# EAGLE design Drive Board 2018-19 (EAGLE 7.6.0)
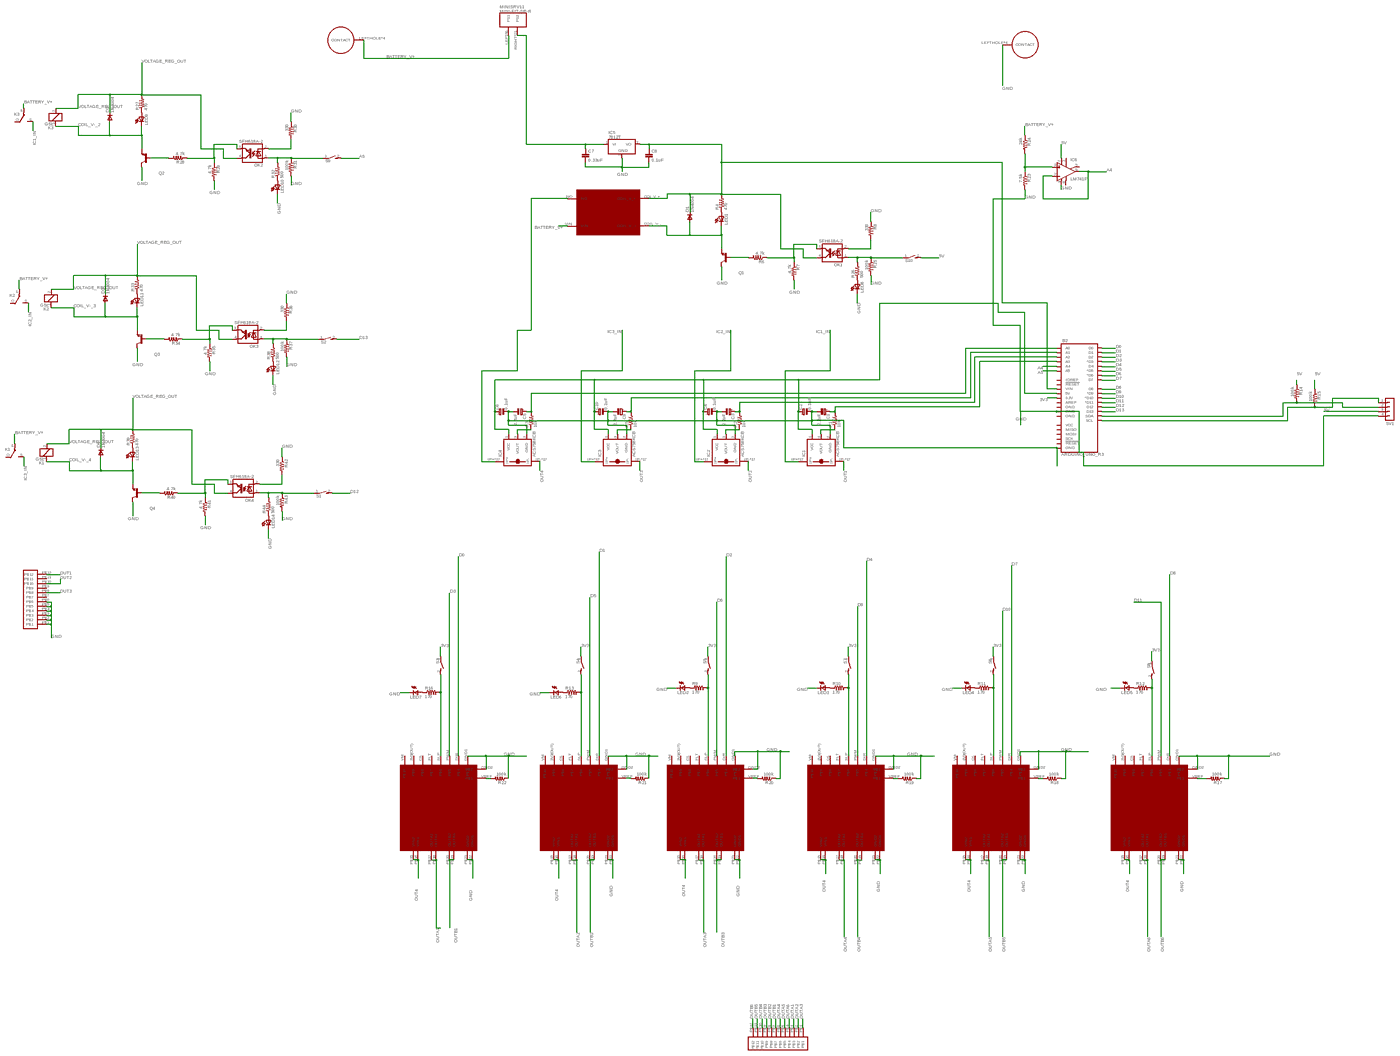
[diagram p0: schematic, sheet 1, overview]
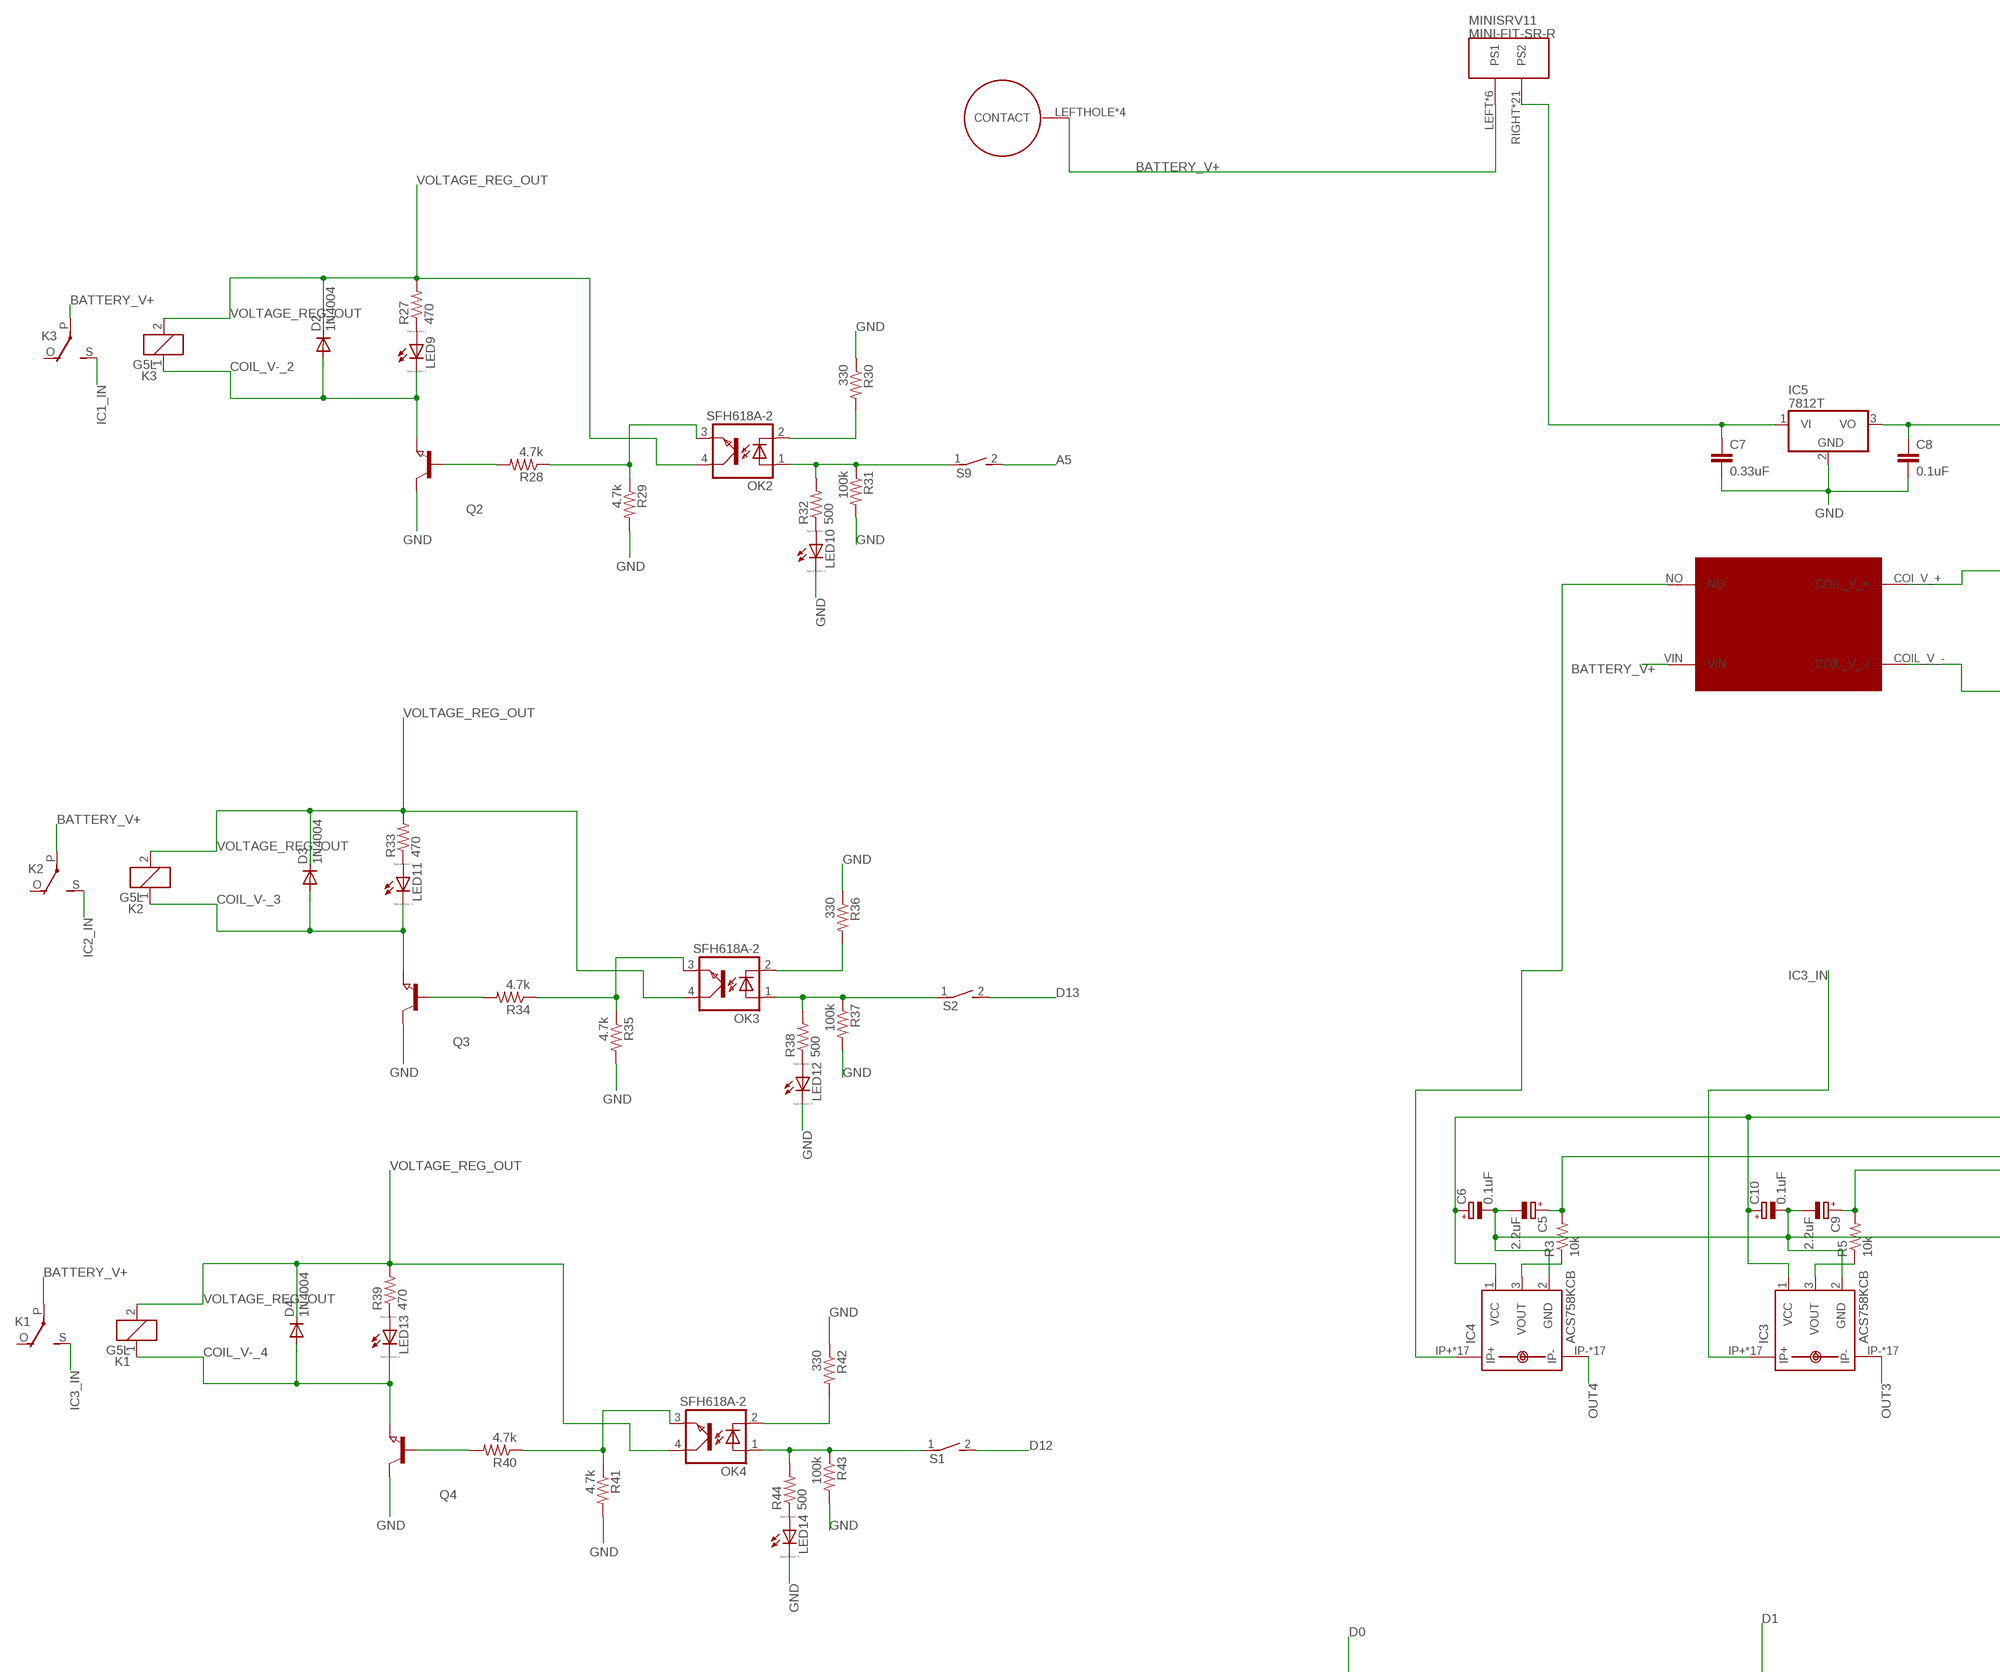
[diagram p1: schematic, sheet 1, part 1 of 4]
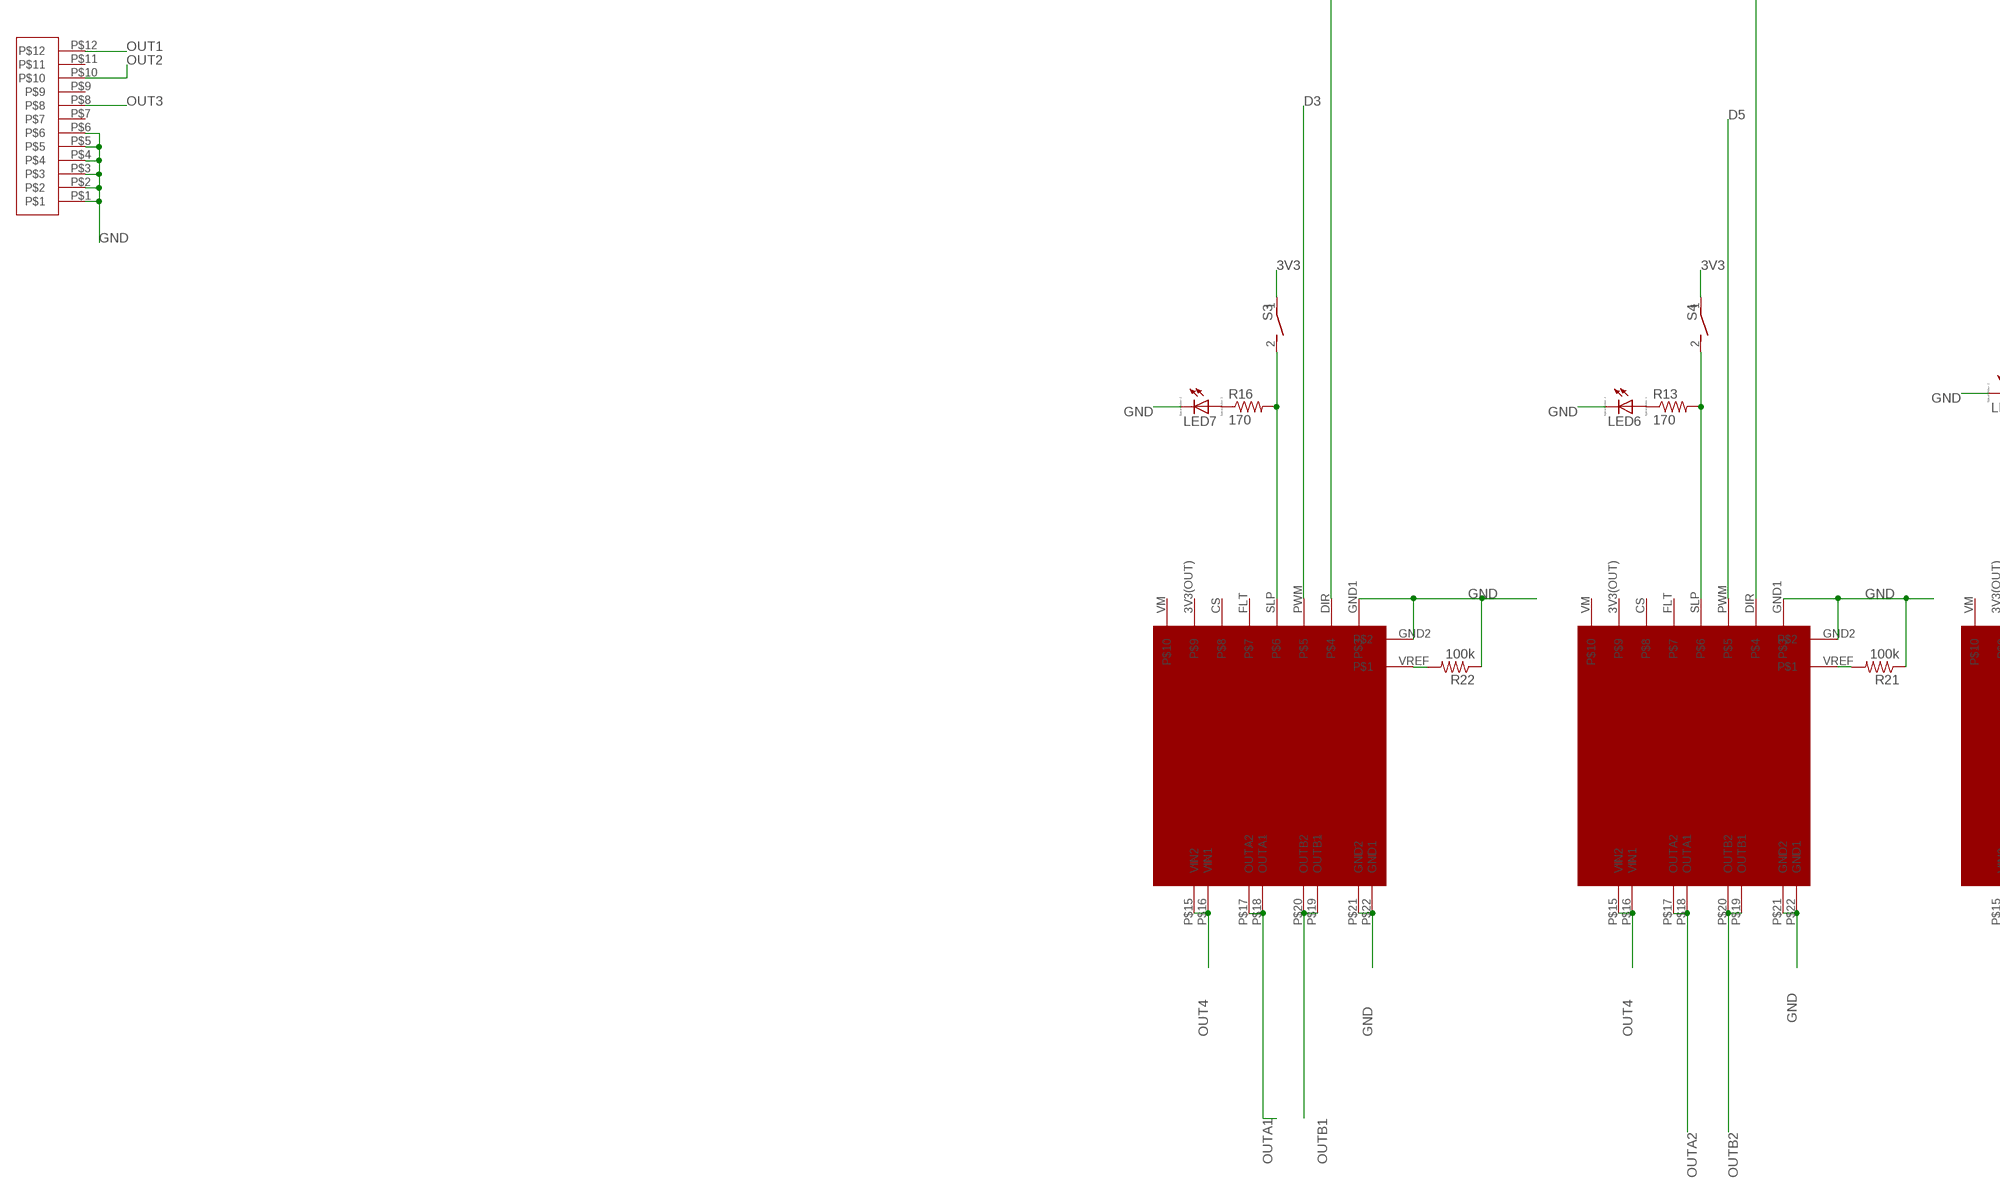
[diagram p2: schematic, sheet 1, part 2 of 4]
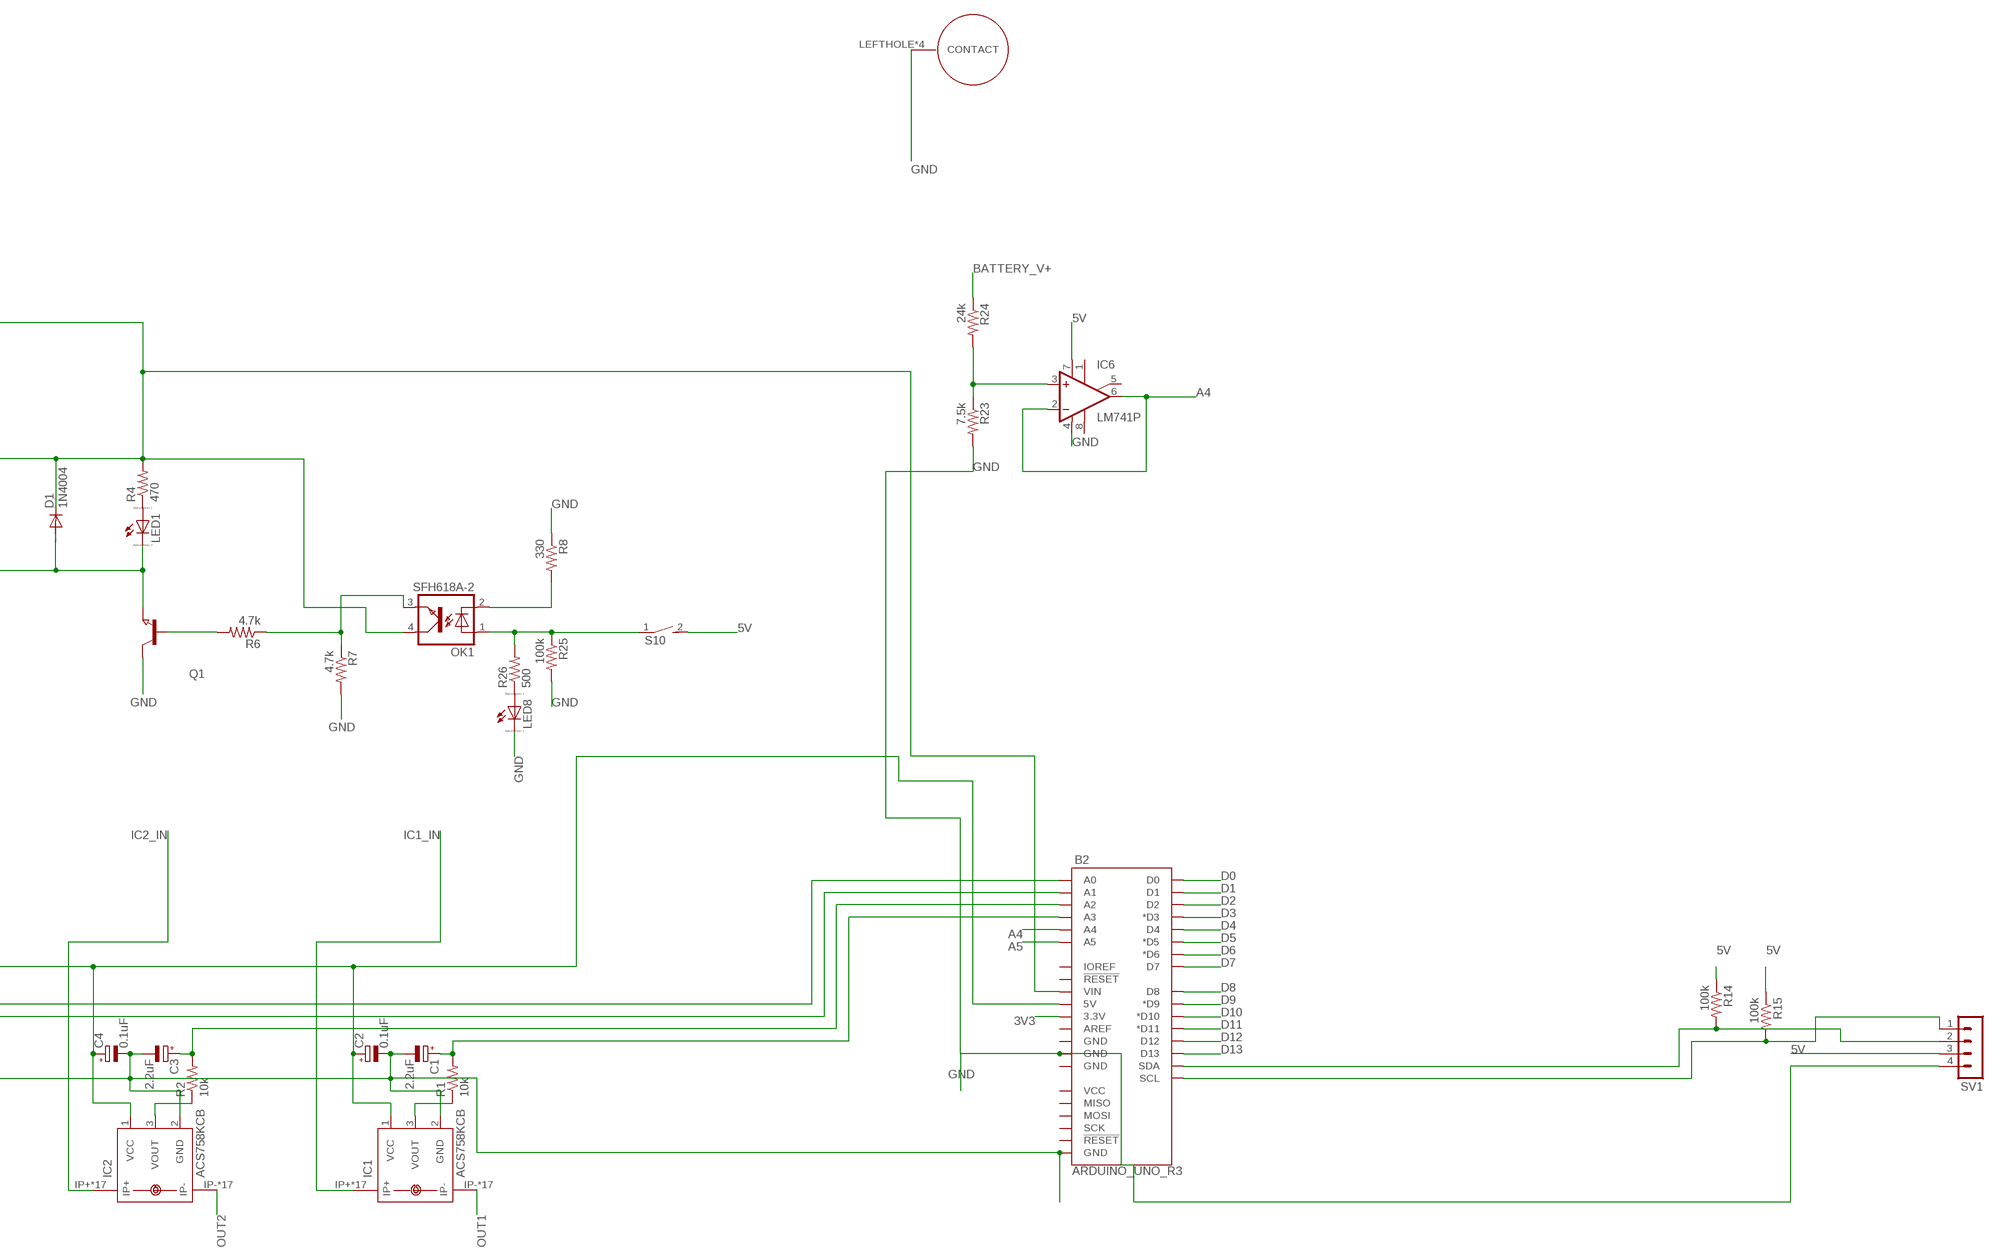
[diagram p3: schematic, sheet 1, part 3 of 4]
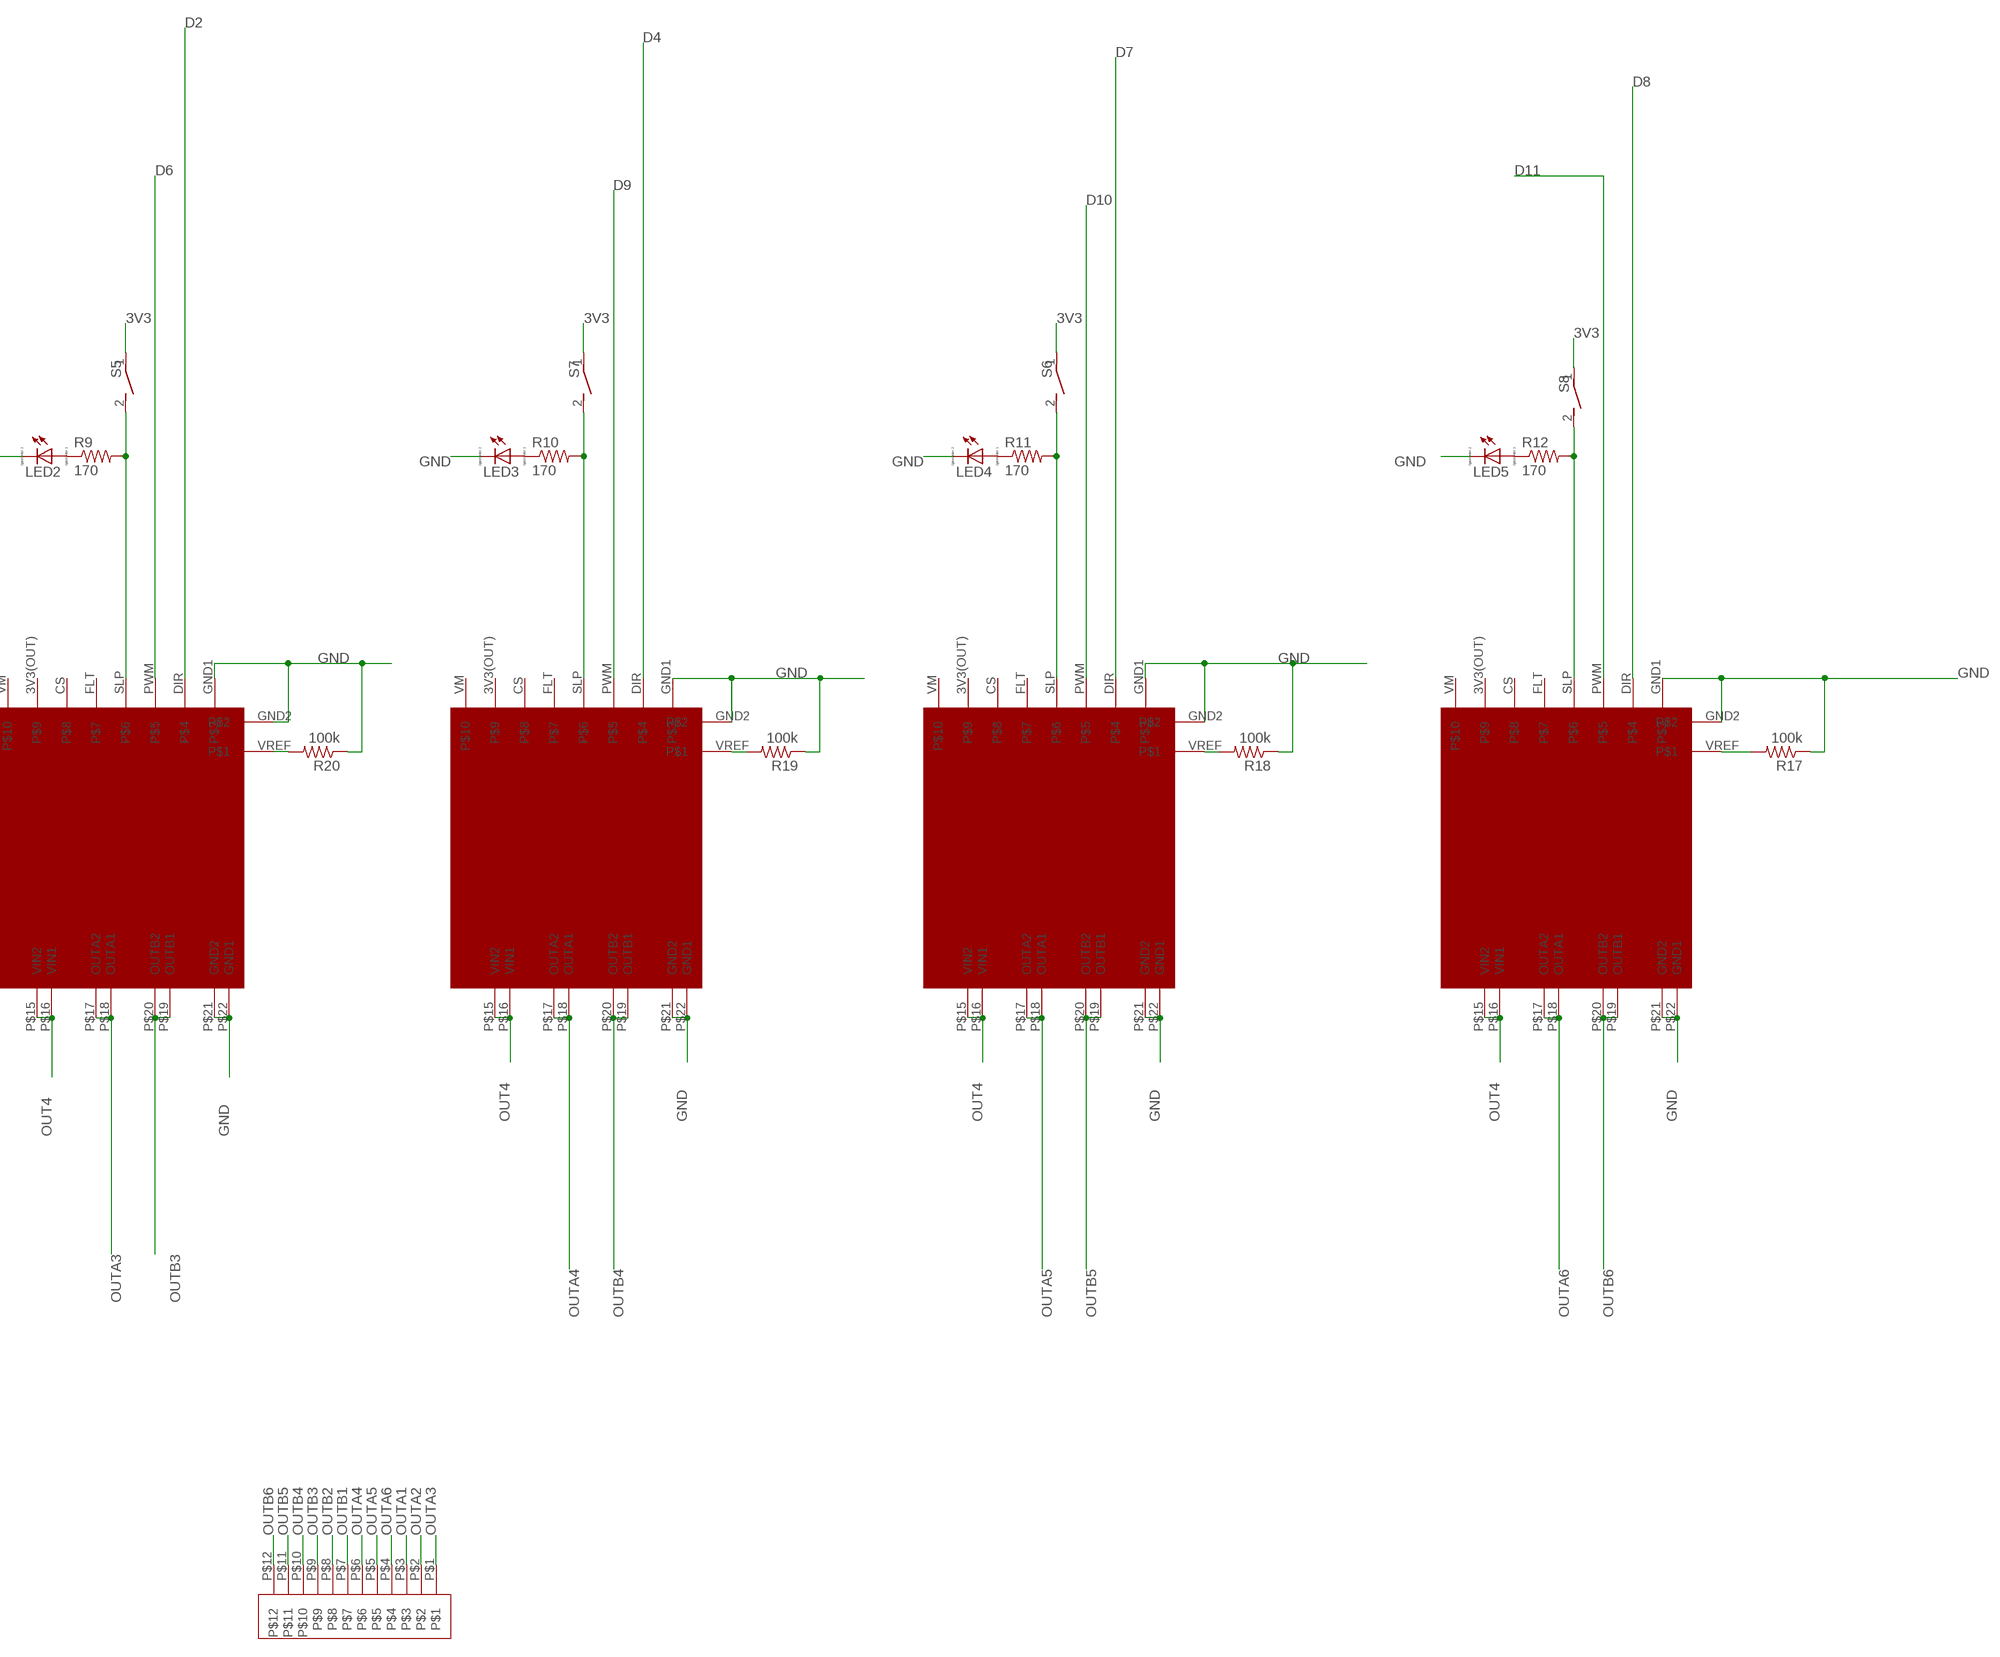
[diagram p4: schematic, sheet 1, part 4 of 4]

## Parts
B2  ARDUINO_UNO_R3  [ARDUINO_R3]
C1  2.2uF  CPOL-EUE2.5-6  [E2,5-6]
C2  0.1uF  CPOL-EUE2.5-6  [E2,5-6]
C3  2.2uF  CPOL-EUE2.5-6  [E2,5-6]
C4  0.1uF  CPOL-EUE2.5-6  [E2,5-6]
C5  2.2uF  CPOL-EUE2.5-6  [E2,5-6]
C6  0.1uF  CPOL-EUE2.5-6  [E2,5-6]
C7  0.33uF  C5/5.5  [C5B5.5]
C8  0.1uF  C5/5.5  [C5B5.5]
C9  2.2uF  CPOL-EUE2.5-6  [E2,5-6]
C10  0.1uF  CPOL-EUE2.5-6  [E2,5-6]
D1  1N4004  [DO41-10]
D2  1N4004  [DO41-10]
D3  1N4004  [DO41-10]
D4  1N4004  [DO41-10]
IC1  ACS758KCB  ACS758KCB-150B-PFF-T  [CB-PFF]
IC2  ACS758KCB  ACS758KCB-150B-PFF-T  [CB-PFF]
IC3  ACS758KCB  ACS758KCB-150B-PFF-T  [CB-PFF]
IC4  ACS758KCB  ACS758KCB-150B-PFF-T  [CB-PFF]
IC5  7812T  [TO220H]
IC6  LM741P  [DIL08]
K1  G5L  [G5LE]
K2  G5L  [G5LE]
K3  G5L  [G5LE]
LED1  LED_E  [LED_1206]
LED2  LED_E  [LED_1206]
LED3  LED_E  [LED_1206]
LED4  LED_E  [LED_1206]
LED5  LED_E  [LED_1206]
LED6  LED_E  [LED_1206]
LED7  LED_E  [LED_1206]
LED8  LED_E  [LED_1206]
LED9  LED_E  [LED_1206]
LED10  LED_E  [LED_1206]
LED11  LED_E  [LED_1206]
LED12  LED_E  [LED_1206]
LED13  LED_E  [LED_1206]
LED14  LED_E  [LED_1206]
MINISRV11  MINI-FIT-SR-R  [MINI-FIT-SR-R]
OK1  SFH618A-2  [DIP4]
OK2  SFH618A-2  [DIP4]
OK3  SFH618A-2  [DIP4]
OK4  SFH618A-2  [DIP4]
Q1  NPN-TRANSISTOR_SOT23  [SOT23]
Q2  NPN-TRANSISTOR_SOT23  [SOT23]
Q3  NPN-TRANSISTOR_SOT23  [SOT23]
Q4  NPN-TRANSISTOR_SOT23  [SOT23]
R1  10k  R-US_0204/7  [0204/7]
R2  10k  R-US_0204/7  [0204/7]
R3  10k  R-US_0204/7  [0204/7]
R4  470  R-US_0207/10  [0207/10]
R5  10k  R-US_0204/7  [0204/7]
R6  4.7k  R-US_0207/10  [0207/10]
R7  4.7k  R-US_0207/10  [0207/10]
R8  330  R-US_0207/10  [0207/10]
R9  170  R-US_0207/10  [0207/10]
R10  170  R-US_0207/10  [0207/10]
R11  170  R-US_0207/10  [0207/10]
R12  170  R-US_0207/10  [0207/10]
R13  170  R-US_0207/10  [0207/10]
R14  100k  R-US_0207/10  [0207/10]
R15  100k  R-US_0207/10  [0207/10]
R16  170  R-US_0207/10  [0207/10]
R17  100k  R-US_0207/10  [0207/10]
R18  100k  R-US_0207/10  [0207/10]
R19  100k  R-US_0207/10  [0207/10]
R20  100k  R-US_0207/10  [0207/10]
R21  100k  R-US_0207/10  [0207/10]
R22  100k  R-US_0207/10  [0207/10]
R23  7.5k  R-US_0207/10  [0207/10]
R24  24k  R-US_0207/10  [0207/10]
R25  100k  R-US_0207/10  [0207/10]
R26  500  R-US_0207/10  [0207/10]
R27  470  R-US_0207/10  [0207/10]
R28  4.7k  R-US_0207/10  [0207/10]
R29  4.7k  R-US_0207/10  [0207/10]
R30  330  R-US_0207/10  [0207/10]
R31  100k  R-US_0207/10  [0207/10]
R32  500  R-US_0207/10  [0207/10]
R33  470  R-US_0207/10  [0207/10]
R34  4.7k  R-US_0207/10  [0207/10]
R35  4.7k  R-US_0207/10  [0207/10]
R36  330  R-US_0207/10  [0207/10]
R37  100k  R-US_0207/10  [0207/10]
R38  500  R-US_0207/10  [0207/10]
R39  470  R-US_0207/10  [0207/10]
R40  4.7k  R-US_0207/10  [0207/10]
R41  4.7k  R-US_0207/10  [0207/10]
R42  330  R-US_0207/10  [0207/10]
R43  100k  R-US_0207/10  [0207/10]
R44  500  R-US_0207/10  [0207/10]
S1  DS01E  [DS-01]
S2  DS01E  [DS-01]
S3  DS01E  [DS-01]
S4  DS01E  [DS-01]
S5  DS01E  [DS-01]
S6  DS01E  [DS-01]
S7  DS01E  [DS-01]
S8  DS01E  [DS-01]
S9  DS01E  [DS-01]
S10  DS01E  [DS-01]
SV1  MA04-1  [MA04-1]
U$1  HPMD18V17  [HPMD18V17]
U$2  HPMD18V17  [HPMD18V17]
U$3  HPMD18V17  [HPMD18V17]
U$4  HPMD18V17  [HPMD18V17]
U$5  HPMD18V17  [HPMD18V17]
U$6  HPMD18V17  [HPMD18V17]
U$7  BUSBAR_MOUNT  [BUSBAR_MOUNT]
U$9  BUSBAR_MOUNT  [BUSBAR_MOUNT]
U$11  JTN1AS-PA-F-DC12V  [JTN1AS-PA-F-DC12V]
U$12  MEGA-FIT_RA_12  [MEGA-FIT_RA_12]
U$13  MEGA-FIT_RA_12  [MEGA-FIT_RA_12]

## Nets
3V3: B2.3.3V S3.1 S4.1 S5.1 S6.1 S7.1 S8.1
5V: B2.5V C2.+ C4.+ C6.+ C10.+ IC1.1(VCC) IC2.1(VCC) IC3.1(VCC) IC4.1(VCC) IC6.7(V+) R14.1 R15.1 S10.2 SV1.3
A4: B2.A4 IC6.2(-IN) IC6.6(OUT)
A5: B2.A5 S9.2
BATTERY_V+: K1.P(2:P) K2.P(2:P) K3.P(2:P) MINISRV11.LEFT(PS1) MINISRV11.LEFT@1(PS1) MINISRV11.LEFT@2(PS1) MINISRV11.LEFT@3(PS1) MINISRV11.LEFT@4(PS1) MINISRV11.LEFT@5(PS1) R24.1 U$7.LEFTHOLE(CONTACT) U$7.P$1(CONTACT) U$7.P$2(CONTACT) U$7.RIGHTHOLE(CONTACT) U$11.VIN
COIL_V-_1: D1.A LED1.C Q1.2(E) U$11.COIL_V_-(COIL_V_-\)
COIL_V-_2: D2.A K3.1 LED9.C Q2.2(E)
COIL_V-_3: D3.A K2.1 LED11.C Q3.2(E)
COIL_V-_4: D4.A K1.1 LED13.C Q4.2(E)
D0: B2.D0 U$1.DIR
D1: B2.D1 U$2.DIR
D2: B2.D2 U$3.DIR
D3: B2.D3(*D3) U$1.PWM
D4: B2.D4 U$4.DIR
D5: B2.D5(*D5) U$2.PWM
D6: B2.D6(*D6) U$3.PWM
D7: B2.D7 U$5.DIR
D8: B2.D8 U$6.DIR
D9: B2.D9(*D9) U$4.PWM
D10: B2.D10(*D10) U$5.PWM
D11: B2.D11(*D11) U$6.PWM
D12: B2.D12 S1.2
D13: B2.D13 S2.2
ESTOP: C7.1 IC5.1(VI) MINISRV11.RIGHT(PS2) MINISRV11.RIGHT@1(PS2) MINISRV11.RIGHT@2(PS2) MINISRV11.RIGHT@3(PS2) MINISRV11.RIGHT@4(PS2) MINISRV11.RIGHT@5(PS2) MINISRV11.RIGHT@6(PS2) MINISRV11.RIGHT@7(PS2) MINISRV11.RIGHT@8(PS2) MINISRV11.RIGHT@9(PS2) MINISRV11.RIGHT@10(PS2) MINISRV11.RIGHT@11(PS2) MINISRV11.RIGHT@12(PS2) MINISRV11.RIGHT@13(PS2) MINISRV11.RIGHT@14(PS2) MINISRV11.RIGHT@15(PS2) MINISRV11.RIGHT@16(PS2) MINISRV11.RIGHT@17(PS2) MINISRV11.RIGHT@18(PS2) MINISRV11.RIGHT@19(PS2) MINISRV11.RIGHT@20(PS2)
GND: B2.GND@1(GND) B2.GND@3(GND) C1.- C2.- C3.- C4.- C5.- C6.- C7.2 C8.2 C9.- C10.- IC1.2(GND) IC2.2(GND) IC3.2(GND) IC4.2(GND) IC5.2(GND) IC6.4(V-) LED2.C LED3.C LED4.C LED5.C LED6.C LED7.C LED8.C LED10.C LED12.C LED14.C Q1.3(C) Q2.3(C) Q3.3(C) Q4.3(C) R7.2 R8.1 R17.1 R18.1 R19.1 R20.1 R21.1 R22.1 R23.2 R25.2 R29.2 R30.1 R31.2 R35.2 R36.1 R37.2 R41.2 R42.1 R43.2 SV1.4 U$1.GND1 U$1.GND2 U$1.P$21(GND2) U$1.P$22(GND1) U$2.GND1 U$2.GND2 U$2.P$21(GND2) U$2.P$22(GND1) U$3.GND1 U$3.GND2 U$3.P$21(GND2) U$3.P$22(GND1) U$4.GND1 U$4.GND2 U$4.P$21(GND2) U$4.P$22(GND1) U$5.GND1 U$5.GND2 U$5.P$21(GND2) U$5.P$22(GND1) U$6.GND1 U$6.GND2 U$6.P$21(GND2) U$6.P$22(GND1) U$9.LEFTHOLE(CONTACT) U$9.P$1(CONTACT) U$9.P$2(CONTACT) U$9.RIGHTHOLE(CONTACT) U$13.P$1 U$13.P$2 U$13.P$3 U$13.P$4 U$13.P$5 U$13.P$6
IC1_IN: IC1.IP+ IC1.IP+@2(IP+) IC1.IP+@3(IP+) IC1.IP+@4(IP+) IC1.IP+@5(IP+) IC1.IP+@6(IP+) IC1.IP+@7(IP+) IC1.IP+@8(IP+) IC1.IP+@9(IP+) IC1.IP+@10(IP+) IC1.IP+@11(IP+) IC1.IP+@12(IP+) IC1.IP+@13(IP+) IC1.IP+@14(IP+) IC1.IP+@15(IP+) IC1.IP+@16(IP+) IC1.IP+@17(IP+) K3.S(2:S)
IC2_IN: IC2.IP+ IC2.IP+@2(IP+) IC2.IP+@3(IP+) IC2.IP+@4(IP+) IC2.IP+@5(IP+) IC2.IP+@6(IP+) IC2.IP+@7(IP+) IC2.IP+@8(IP+) IC2.IP+@9(IP+) IC2.IP+@10(IP+) IC2.IP+@11(IP+) IC2.IP+@12(IP+) IC2.IP+@13(IP+) IC2.IP+@14(IP+) IC2.IP+@15(IP+) IC2.IP+@16(IP+) IC2.IP+@17(IP+) K2.S(2:S)
IC3_IN: IC3.IP+ IC3.IP+@2(IP+) IC3.IP+@3(IP+) IC3.IP+@4(IP+) IC3.IP+@5(IP+) IC3.IP+@6(IP+) IC3.IP+@7(IP+) IC3.IP+@8(IP+) IC3.IP+@9(IP+) IC3.IP+@10(IP+) IC3.IP+@11(IP+) IC3.IP+@12(IP+) IC3.IP+@13(IP+) IC3.IP+@14(IP+) IC3.IP+@15(IP+) IC3.IP+@16(IP+) IC3.IP+@17(IP+) K1.S(2:S)
N$1: LED8.A R26.1
N$2: IC1.3(VOUT) R1.1
N$3: LED1.A R4.1
N$4: B2.A3 C1.+ R1.2
N$5: IC6.3(+IN) R23.1 R24.2
N$6: IC2.3(VOUT) R2.1
N$7: LED9.A R27.1
N$8: B2.A2 C3.+ R2.2
N$9: Q2.1(B) R28.2
N$10: IC4.3(VOUT) R3.1
N$11: OK2.3(EMIT) R28.1 R29.1
N$12: OK2.2(C) R30.2
N$13: B2.A1 C9.+ R5.2
N$14: LED10.A R32.1
N$15: LED11.A R33.1
N$16: Q1.1(B) R6.2
N$17: IC3.3(VOUT) R5.1
N$18: Q3.1(B) R34.2
N$19: B2.A0 C5.+ R3.2
N$20: OK3.3(EMIT) R34.1 R35.1
N$21: OK1.3(EMIT) R6.1 R7.1
N$22: OK3.2(C) R36.2
N$23: LED12.A R38.1
N$24: IC4.IP+ IC4.IP+@2(IP+) IC4.IP+@3(IP+) IC4.IP+@4(IP+) IC4.IP+@5(IP+) IC4.IP+@6(IP+) IC4.IP+@7(IP+) IC4.IP+@8(IP+) IC4.IP+@9(IP+) IC4.IP+@10(IP+) IC4.IP+@11(IP+) IC4.IP+@12(IP+) IC4.IP+@13(IP+) IC4.IP+@14(IP+) IC4.IP+@15(IP+) IC4.IP+@16(IP+) IC4.IP+@17(IP+) U$11.NO
N$25: LED13.A R39.1
N$26: Q4.1(B) R40.2
N$27: OK4.3(EMIT) R40.1 R41.1
N$28: OK4.2(C) R42.2
N$29: LED14.A R44.1
N$34: OK1.2(C) R8.2
N$35: R18.2 U$5.VREF
N$37: R20.2 U$3.VREF
N$50: LED2.A R9.1
N$51: R17.2 U$6.VREF
N$52: B2.SCL R15.2 SV1.1
N$53: B2.SDA R14.2 SV1.2
N$54: LED3.A R10.1
N$56: LED4.A R11.1
N$60: LED5.A R12.1
N$61: R19.2 U$4.VREF
N$62: LED6.A R13.1
N$64: LED7.A R16.1
N$65: R21.2 U$2.VREF
N$66: R22.2 U$1.VREF
N$72: R12.2 S8.2 U$6.SLP
N$73: R11.2 S6.2 U$5.SLP
N$74: R10.2 S7.2 U$4.SLP
N$75: R9.2 S5.2 U$3.SLP
N$76: R13.2 S4.2 U$2.SLP
N$77: R16.2 S3.2 U$1.SLP
OPTO1: OK2.1(A) R31.1 R32.2 S9.1
OPTO2: OK3.1(A) R37.1 R38.2 S2.1
OPTO3: OK4.1(A) R43.1 R44.2 S1.1
OPTO4: OK1.1(A) R25.1 R26.2 S10.1
OUT1: IC1.IP- IC1.IP-@2(IP-) IC1.IP-@3(IP-) IC1.IP-@4(IP-) IC1.IP-@5(IP-) IC1.IP-@6(IP-) IC1.IP-@7(IP-) IC1.IP-@8(IP-) IC1.IP-@9(IP-) IC1.IP-@10(IP-) IC1.IP-@11(IP-) IC1.IP-@12(IP-) IC1.IP-@13(IP-) IC1.IP-@14(IP-) IC1.IP-@15(IP-) IC1.IP-@16(IP-) IC1.IP-@17(IP-) U$13.P$12
OUT2: IC2.IP- IC2.IP-@2(IP-) IC2.IP-@3(IP-) IC2.IP-@4(IP-) IC2.IP-@5(IP-) IC2.IP-@6(IP-) IC2.IP-@7(IP-) IC2.IP-@8(IP-) IC2.IP-@9(IP-) IC2.IP-@10(IP-) IC2.IP-@11(IP-) IC2.IP-@12(IP-) IC2.IP-@13(IP-) IC2.IP-@14(IP-) IC2.IP-@15(IP-) IC2.IP-@16(IP-) IC2.IP-@17(IP-) U$13.P$10
OUT3: IC3.IP- IC3.IP-@2(IP-) IC3.IP-@3(IP-) IC3.IP-@4(IP-) IC3.IP-@5(IP-) IC3.IP-@6(IP-) IC3.IP-@7(IP-) IC3.IP-@8(IP-) IC3.IP-@9(IP-) IC3.IP-@10(IP-) IC3.IP-@11(IP-) IC3.IP-@12(IP-) IC3.IP-@13(IP-) IC3.IP-@14(IP-) IC3.IP-@15(IP-) IC3.IP-@16(IP-) IC3.IP-@17(IP-) U$13.P$8
OUT4: IC4.IP- IC4.IP-@2(IP-) IC4.IP-@3(IP-) IC4.IP-@4(IP-) IC4.IP-@5(IP-) IC4.IP-@6(IP-) IC4.IP-@7(IP-) IC4.IP-@8(IP-) IC4.IP-@9(IP-) IC4.IP-@10(IP-) IC4.IP-@11(IP-) IC4.IP-@12(IP-) IC4.IP-@13(IP-) IC4.IP-@14(IP-) IC4.IP-@15(IP-) IC4.IP-@16(IP-) IC4.IP-@17(IP-) U$1.P$15(VIN2) U$1.P$16(VIN1) U$2.P$15(VIN2) U$2.P$16(VIN1) U$3.P$15(VIN2) U$3.P$16(VIN1) U$4.P$15(VIN2) U$4.P$16(VIN1) U$5.P$15(VIN2) U$5.P$16(VIN1) U$6.P$15(VIN2) U$6.P$16(VIN1)
OUTA1: U$1.P$17(OUTA2) U$1.P$18(OUTA1) U$12.P$3
OUTA2: U$2.P$17(OUTA2) U$2.P$18(OUTA1) U$12.P$2
OUTA3: U$3.P$17(OUTA2) U$3.P$18(OUTA1) U$12.P$1
OUTA4: U$4.P$17(OUTA2) U$4.P$18(OUTA1) U$12.P$6
OUTA5: U$5.P$17(OUTA2) U$5.P$18(OUTA1) U$12.P$5
OUTA6: U$6.P$17(OUTA2) U$6.P$18(OUTA1) U$12.P$4
OUTB1: U$1.P$19(OUTB1) U$1.P$20(OUTB2) U$12.P$7
OUTB2: U$2.P$19(OUTB1) U$2.P$20(OUTB2) U$12.P$8
OUTB3: U$3.P$19(OUTB1) U$3.P$20(OUTB2) U$12.P$9
OUTB4: U$4.P$19(OUTB1) U$4.P$20(OUTB2) U$12.P$10
OUTB5: U$5.P$19(OUTB1) U$5.P$20(OUTB2) U$12.P$11
OUTB6: U$6.P$19(OUTB1) U$6.P$20(OUTB2) U$12.P$12
VOLTAGE_REG_OUT: B2.VIN C8.1 D1.C D2.C D3.C D4.C IC5.3(VO) K1.2 K2.2 K3.2 OK1.4(COL) OK2.4(COL) OK3.4(COL) OK4.4(COL) R4.2 R27.2 R33.2 R39.2 U$11.COI_V_+(COIL_V_+)
Unconnected: B2.AREF B2.GND@2(GND) B2.GND@4(GND) B2.IOREF B2.MISO B2.MOSI B2.RESET@1(!RESET!) B2.RESET@2(!RESET!) B2.SCK B2.VCC IC6.1(ON1) IC6.5(ON2) IC6.8(OPT) K1.O(2:O) K2.O(2:O) K3.O(2:O) U$1.3V3(OUT) U$1.CS U$1.FLT U$1.VM U$2.3V3(OUT) U$2.CS U$2.FLT U$2.VM U$3.3V3(OUT) U$3.CS U$3.FLT U$3.VM U$4.3V3(OUT) U$4.CS U$4.FLT U$4.VM U$5.3V3(OUT) U$5.CS U$5.FLT U$5.VM U$6.3V3(OUT) U$6.CS U$6.FLT U$6.VM U$13.P$7 U$13.P$9 U$13.P$11

## Library data of the parts
B2 = SparkFun-Boards:ARDUINO_UNO_R3: Arduino R3 Footprint with SPI header Arduino Uno R3 Compatible Footprint. Matches PCB size of the original board. SparkFun Products: SAMD21 Dev Breakout <�https://www.sparkfun.com/products/13672�> RedBoard <�https://www.sparkfun.com/products/12757�> R3 Stackable Headers <�https://www.sparkfun.com/products/11417>
C1-C6 C9 C10 = rcl:CPOL-EU: POLARIZED CAPACITOR, European symbol
C7 C8 = capacitor-wima:C: CAPACITOR naming: grid - package width
D1-D4 = diode:1N4004: DIODE general purpose rectifier, 1 A
IC1-IC4 = ALLEGRO:ACS758*: Thermally Enhanced, Fully Integrated, Hall Effect-Based Linear Current Sensor with 100 micro Ohm Current Conductor display layer 49 Reference in BRD and place VIAs on circles Source: http://www.allegromicro.com/en/Products/Part_Numbers/0758/0758.pdf; MPN: ACS758KCB-150B-PFF-T; OC_FARNELL: 1718995; OC_NEWARK: 04R7129
IC5 = adafruit:78*: Positive VOLTAGE REGULATOR Added bigger pads to the TO-92 package
IC6 = linear:*741: OP AMP
K1-K3 = relay:G5L: RELAY 1 x switch, 10 A/120 V AC, 8 A/30 V ADC, Omron
LED1-LED14 = eagle-ltspice:LED_E: LED Source: http://www.osram.convergy.de Source: www.luxeon.com Source: www.kingbright.com; SPICEMODEL: NONE; SPICEPREFIX: D; SPICETYPE: diode
MINISRV11 = Molex:MINI-FIT-SR-R
OK1-OK4 = optocoupler:SFH618?*: Optocoupler, Phototransistor Output, Low Input Current Source: Data sheet <http://www.vishay.com/docs/83673/sfh618.pdf>; MF: VISHAY/TELEFUNKEN; MPN: SFH618A-2; OC_FARNELL: 6424855; OC_NEWARK: 21H7744
Q1-Q4 = semicon-smd-ipc:NPN-TRANSISTOR_: NPN TRANSISTOR
R1-R44 = resistor:R-US_: RESISTOR, American symbol
S1-S10 = switch-dil:DS01E: DIL/CODE SWITCH; OC_FARNELL: unknown; OC_NEWARK: unknown
SV1 = con-lstb:MA04-1: PIN HEADER; OC_FARNELL: unknown; OC_NEWARK: unknown
U$1-U$6 = RSX_Driver_Boards:HPMD18V17
U$7 U$9 = RSX_Busbar_contact:BUSBAR_MOUNT
U$11 = RSX_driver_relay:JTN1AS-PA-F-DC12V
U$12 U$13 = RSX:MEGA-FIT_RA_12

## Board
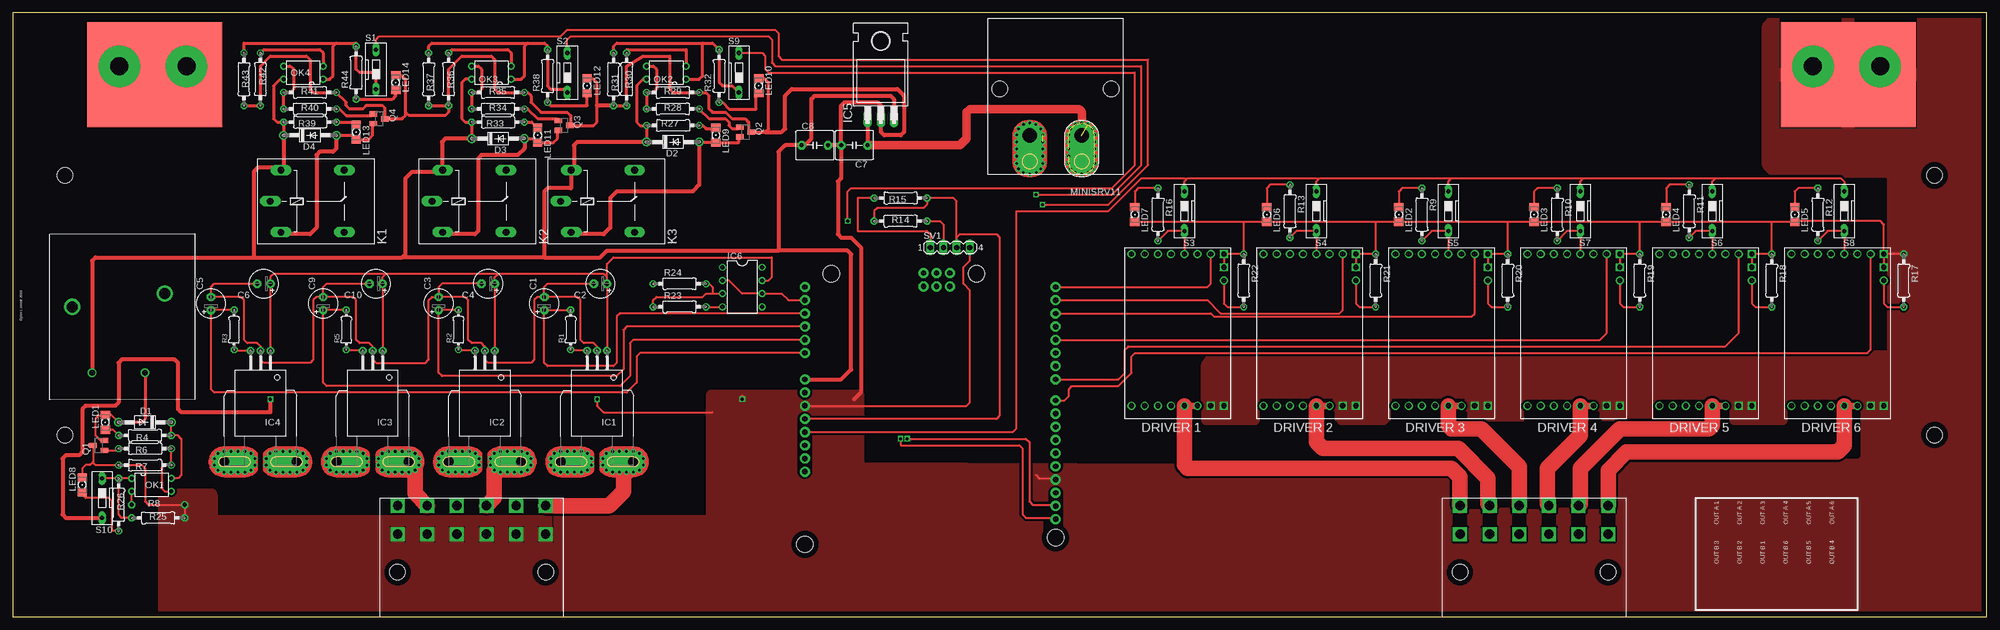
[diagram p5: board, top side]
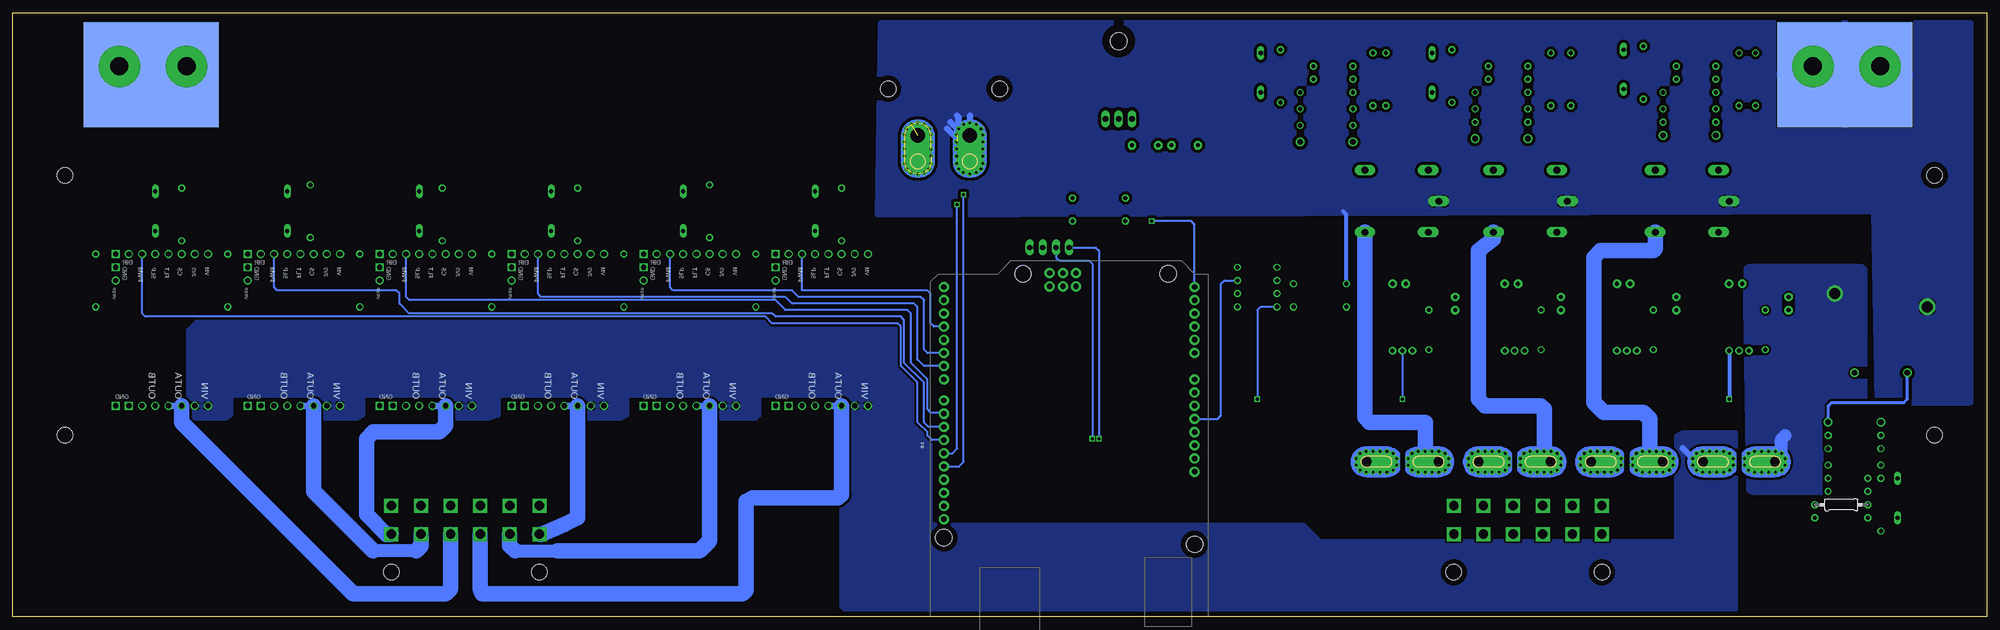
[diagram p6: board, bottom side, seen from below]

Size 379.8 x 116.27 mm. Coordinates in mm from the lower left corner, seen from the top.
Outline: 0,0 379.8,0 379.8,116.27 0,116.27 0,0
Copper layers (1*16): Top 0.035mm / dielectric 1.5mm / Bottom 0.035mm
Design rules "default": minimum track width 10mil, minimum drill 24mil, track to track 8mil, track to pad 8mil, pad to pad 8mil, via to via 8mil, smd to smd 8mil, copper to edge 40mil, drill to drill 8mil, minimum pad ring 10mil, minimum via ring 8mil, stop-mask expansion 4mil, vias tented up to drill 0mil, thermal gap 10mil
Holes 3 mm at 10,85 10,35 369.8,85 369.8,35

### Footprints (pad centres in the part's own frame; a part is rotated, then mirrored left to right if it is on the bottom)
ARDUINO_R3 = drill 1.016 pad 1.93: 3.3V 2.54,-24.13; 5V 5.08,-24.13; A0 17.78,-24.13; A1 20.32,-24.13; A2 22.86,-24.13; A3 25.4,-24.13; A4 27.94,-24.13; A5 30.48,-24.13; AREF -9.144,24.13; D0 30.48,24.13; D1 27.94,24.13; D2 25.4,24.13; D3 22.86,24.13; D4 20.32,24.13; D5 17.78,24.13; D6 15.24,24.13; D7 12.7,24.13; D8 8.636,24.13; D9 6.096,24.13; D10 3.556,24.13; D11 1.016,24.13; D12 -1.524,24.13; D13 -4.064,24.13; GND@1 7.62,-24.13; GND@2 10.16,-24.13; GND@3 -6.604,24.13; GND@4 33.16,-1.32; IOREF -2.54,-24.13; MISO 30.62,3.76; MOSI 33.16,1.22; NC -5.08,-24.13; RESET@1 0,-24.13; RESET@2 30.62,-1.32; SCK 30.62,1.22; SCL -14.224,24.13; SDA -11.684,24.13; VCC 33.16,3.76; VIN 12.7,-24.13 | hole 3.175: -17.78,24.13; 33.02,8.89; 33.02,-19.05; -19.05,-24.13
E2,5-6 = drill 0.813 pad 1.6: + -1.27,0 | drill 0.813 pad 1.6 octagon: - 1.27,0
C5B5.5 = drill 0.813 pad 1.6 octagon: 1 -2.54,0; 2 2.54,0
DO41-10 = drill 1.118: A 5.08,0; C -5.08,0
CB-PFF = drill 0.8 pad 1.5: 1 -1.91,-21.4; 2 0,-21.4; 3 1.91,-21.4 | drill 2 pad 4 offset: IP+ 7,0; IP- -7,0 | drill 0.5 pad 0.9: IP+@2 8.89,0.635; IP+@3 8.89,-0.635; IP+@4 8.175,-1.625; IP+@5 7,-2; IP+@6 5.675,-2; IP+@7 4.35,-2; IP+@8 3,-2; IP+@9 1.825,-1.625; IP+@10 1.1,-0.625; IP+@11 1.1,0.625; IP+@12 1.825,1.625; IP+@13 3,2; IP+@14 4.35,2; IP+@15 5.675,2; IP+@16 7,2; IP+@17 8.175,1.625; IP-@2 -8.89,0.635; IP-@3 -8.89,-0.635; IP-@4 -8.175,-1.625; IP-@5 -7,-2; IP-@6 -5.675,-2; IP-@7 -4.325,-2; IP-@8 -3,-2; IP-@9 -1.825,-1.625; IP-@10 -1.1,-0.625; IP-@11 -1.1,0.625; IP-@12 -1.825,1.625; IP-@13 -3,2; IP-@14 -4.325,2; IP-@15 -5.675,2; IP-@16 -7,2; IP-@17 -8.175,1.625
TO220H = drill 1.118 long: 1 -2.54,-10.16; 2 0,-10.16; 3 2.54,-10.16 | hole 3.302: 0,4.826
DIL08 = drill 0.813 pad 1.27: 1 -3.81,-3.81; 2 -1.27,-3.81; 3 1.27,-3.81; 4 3.81,-3.81; 5 3.81,3.81; 6 1.27,3.81; 7 -1.27,3.81; 8 -3.81,3.81
G5LE = drill 1.321 long: 1 -7.493,-5.969; 2 -7.493,5.969; O 4.699,5.969; P -9.525,0; S 4.699,-5.969
LED_1206 = smd 1.6 x 1.803: A -1.422,0; C 1.422,0
MINI-FIT-SR-R = drill 2.8 pad 5 offset: LEFT -5,-7.66; RIGHT 5,-7.66 | drill 0.5 pad 0.9: LEFT@1 -5,-5.25; LEFT@2 -3.8,-5.55; LEFT@3 -2.85,-6.35; LEFT@4 -2.5,-7.5; LEFT@5 -2.5,-8.875; P$2 -6.2,-5.55; P$3 -7.15,-6.35; P$4 -7.5,-7.5; P$8 -7.5,-13; P$9 -7.5,-11.625; P$10 -7.5,-10.25; P$11 -7.5,-8.875; P$12 -5,-15.05; P$13 -7.15,-14.1; P$14 -6.25,-14.75; P$15 -3.75,-14.75; P$16 -2.85,-14.1; P$17 -2.5,-13; P$19 -2.5,-10.25; P$20 -2.5,-11.625; RIGHT@1 5,-5.25; RIGHT@2 6.2,-5.55; RIGHT@3 7.15,-6.35; RIGHT@4 7.5,-7.5; RIGHT@5 7.5,-8.875; RIGHT@6 7.5,-10.25; RIGHT@7 7.5,-11.625; RIGHT@8 7.5,-13; RIGHT@9 7.15,-14.1; RIGHT@10 6.25,-14.75; RIGHT@11 5,-15.05; RIGHT@12 3.75,-14.75; RIGHT@13 2.85,-14.1; RIGHT@14 2.5,-13; RIGHT@15 2.5,-11.625; RIGHT@16 2.5,-10.25; RIGHT@17 2.5,-8.875; RIGHT@18 2.5,-7.5; RIGHT@19 2.85,-6.35; RIGHT@20 3.8,-5.55 | hole 3: -10.73,1.34; 10.73,1.34
DIP4 = drill 0.8: 1 -1.27,-3.81; 2 1.27,-3.81; 3 1.27,3.81; 4 -1.27,3.81
SOT23 = smd 1 x 1.4: 1 -0.95,-1.1; 2 0.95,-1.1; 3 0,1.1
0204/7 = drill 0.813 octagon: 1 -3.81,0; 2 3.81,0
0207/10 = drill 0.813 octagon: 1 -5.08,0; 2 5.08,0
DS-01 = drill 0.813 long: 1 0,-3.81; 2 0,3.81
MA04-1 = drill 1.016 long: 1 -3.81,0; 2 -1.27,0; 3 1.27,0; 4 3.81,0
HPMD18V17 = drill 1.016: 3V3(OUT) -6.35,15.24; CS -3.81,15.24; DIR 6.35,15.24; FLT -1.27,15.24; P$15 -8.89,-13.97; P$16 -6.35,-13.97; P$17 -3.81,-13.97; P$18 -1.27,-13.97; P$19 1.27,-13.97; P$20 3.81,-13.97; PWM 3.81,15.24; SLP 1.27,15.24; VM -8.89,15.24; VREF 8.89,10.16 | drill 1.016 square: GND1 8.89,15.24; GND2 8.89,12.7; P$21 6.35,-13.97; P$22 8.89,-13.97
BUSBAR_MOUNT = drill 3.5 pad 8: LEFTHOLE 0,0; RIGHTHOLE 12.95,0 | smd 25.91 x 20.2 bottom: P$1 6.8,-1.6 | smd 25.91 x 20.2: P$2 6.8,-1.6
JTN1AS-PA-F-DC12V = drill 1.1: COI_V_+ 0,0; COIL_V_- 10.16,0 | drill 2.1: NO 13.97,15.24; VIN -3.81,12.7
MEGA-FIT_RA_12 = drill 1.8 square: P$1 -14.25,15.9; P$2 -8.55,15.9; P$3 -2.85,15.9; P$4 2.85,15.9; P$5 8.55,15.9; P$6 14.25,15.9; P$7 -14.25,21.4; P$8 -8.55,21.4; P$9 -2.85,21.4; P$10 2.85,21.4; P$11 8.55,21.4; P$12 14.25,21.4 | hole 3: -14.25,8.6; 14.25,8.6

### Placement (x,y rotation side)
B2  176.53,33.02 90 bottom
C1  102.23,60.33 90 top
C2  113.03,64.14 180 top
C3  81.92,60.33 90 top
C4  91.44,64.14 180 top
C5  38.1,60.33 90 top
C6  48.26,64.14 180 top
C7  161.93,90.81 180 top
C8  154.31,90.81 0 top
C9  59.69,60.33 90 top
C10  69.85,64.14 180 top
D1  25.4,37.47 180 top
D2  127,91.44 0 top
D3  93.34,92.08 0 top
D4  57.15,92.71 0 top
IC1  112.39,29.84 180 top
IC2  90.81,29.84 180 top
IC3  69.22,29.84 180 top
IC4  47.62,29.84 180 top
IC5  167,106.05 0 top
IC6  140.34,63.5 270 top
K1  59.05,80.01 0 top
K2  90.17,80.01 0 top
K3  114.94,80.01 0 top
LED1  17.78,37.47 90 top
LED2  266.7,77.47 270 top
LED3  292.74,77.47 270 top
LED4  318.13,77.47 270 top
LED5  342.9,77.47 270 top
LED6  241.3,77.47 270 top
LED7  215.9,77.47 270 top
LED8  13.34,25.4 90 top
LED9  135.25,92.71 270 top
LED10  143.51,102.23 90 top
LED11  100.97,92.71 270 top
LED12  110.49,102.23 90 top
LED13  66.04,93.34 270 top
LED14  73.66,102.87 90 top
MINISRV11  200.66,100.33 0 top
OK1  26.67,25.4 270 top
OK2  125.73,104.78 90 top
OK3  92.08,104.78 90 top
OK4  55.88,104.78 90 top
Q1  16.51,33.02 90 top
Q2  140.97,93.34 270 top
Q3  106.05,94.61 270 top
Q4  70.48,95.89 270 top
R1  107.31,55.24 90 top
R2  85.72,55.24 90 top
R3  42.55,55.24 90 top
R4  25.4,34.92 0 top
R5  64.14,55.24 90 top
R6  25.4,32.38 180 top
R7  25.4,29.21 180 top
R8  27.94,21.59 0 bottom
R9  271.14,77.47 270 top
R10  297.18,77.47 270 top
R11  322.58,78.11 270 top
R12  347.35,77.47 270 top
R13  245.75,78.11 270 top
R14  170.81,76.2 0 top
R15  170.81,80.64 180 top
R16  220.34,77.47 270 top
R17  363.86,64.77 270 top
R18  338.45,64.77 270 top
R19  313.06,64.77 270 top
R20  287.65,64.77 270 top
R21  262.25,64.77 270 top
R22  236.85,64.77 270 top
R23  128.27,59.69 0 top
R24  128.27,64.14 0 top
R25  27.94,19.05 0 top
R26  20.32,21.59 90 top
R27  127,94.61 180 top
R28  127,97.79 0 top
R29  127,100.97 0 top
R30  118.11,103.5 90 top
R31  115.57,103.5 270 top
R32  135.89,104.14 90 top
R33  93.34,95.25 180 top
R34  93.34,97.79 0 top
R35  93.34,100.97 0 top
R36  83.82,103.5 90 top
R37  80.01,103.5 270 top
R38  102.87,104.14 90 top
R39  57.15,95.25 180 top
R40  57.15,97.79 0 top
R41  57.15,100.97 0 top
R42  47.62,103.5 90 top
R43  44.45,103.5 270 top
R44  66.04,104.78 90 top
S1  69.85,105.41 0 top
S2  106.68,104.78 0 top
S3  225.43,78.11 180 top
S4  250.82,78.11 180 top
S5  276.23,78.11 180 top
S6  327.02,78.11 180 top
S7  301.62,78.11 180 top
S8  352.43,78.11 180 top
S9  139.7,104.78 0 top
S10  17.14,22.86 180 top
SV1  180.34,71.12 0 top
U$1  224.16,54.61 0 top
U$2  249.56,54.61 0 top
U$3  274.95,54.61 0 top
U$4  300.36,54.61 0 top
U$5  325.75,54.61 0 top
U$6  351.15,54.61 0 top
U$7  20.46,106 0 top
U$9  346.39,106 0 top
U$11  15.24,46.99 0 top
U$12  292.74,0 0 top
U$13  88.27,0 0 top

### Tracks (layer width: path | path; a pad name or v marks a point on that pad's centre or on a via)
3V3
  Top 0.406: S4.1 250.82,83.82 251.14,84.14 | 251.14,84.14 251.46,84.45 276.86,84.45 | 276.86,84.45 302.26,84.45 | 302.26,84.45 327.66,84.45 | 327.66,84.45 351.79,84.45 352.43,83.82 S8.1 | S6.1 327.02,83.82 327.66,84.45 | S7.1 301.62,83.82 302.26,84.45 | S5.1 276.23,83.82 276.86,84.45 | S3.1 225.43,83.82 225.74,84.14 | 225.74,84.14 226.06,84.45 250.82,84.45 251.14,84.14 | B2.3.3V 192.41,35.56 193.04,36.2 193.04,78.11 210.82,78.11 217.17,84.45 225.43,84.45 225.74,84.14
5V  (via drill 0.6)
  Top 0.406: IC4.1 C6.+ 49.53,65.41 50.16,66.04 71.75,66.04 | IC3.1 C10.+ 71.12,65.41 71.75,66.04 | IC2.1 C4.+ 92.71,65.41 93.34,66.04 | IC1.1 C2.+ 114.3,65.41 | 114.3,65.41 113.67,66.04 93.34,66.04 | 93.34,66.04 71.75,66.04 | 114.3,65.41 114.3,67.94 115.57,69.22 146.05,69.22 146.05,65.41 145.41,64.77 IC6.7 | R14.1 165.74,78.11 166.37,78.74 175.26,78.74 175.9,79.38 R15.1 180.97,80.64 181.61,80.01 SV1.3 181.61,73.03 182.25,73.66 189.23,73.66 189.87,73.03 189.87,38.73 189.23,38.1 B2.5V
  Top 0.813: v49.53,41.91 49.53,39.37 32.38,39.37 31.75,40.01 31.75,48.9 31.11,49.53 20.95,49.53 20.32,48.9 20.32,41.27 19.68,40.64 13.97,40.64 13.34,40.01 13.34,31.75 12.7,31.11 10.16,31.11 9.53,30.48 9.53,19.68 10.16,19.05 S10.2
  Bottom 0.406: B2.5V 147.96,38.1 147.32,38.73 147.32,64.14 146.69,64.77 IC6.7
  Bottom 0.813: IC4.1 v49.53,41.91
A4
  Top 0.406: IC6.2 137.79,64.77 140.34,62.23 IC6.6 147.96,62.23 149.22,60.96 B2.A4
A5  (via drill 0.6)
  Top 0.406: S9.2 144.15,108.58 144.78,107.95 144.78,105.41 145.41,104.78 215.9,104.78 215.9,87 211.46,82.55 161.29,82.55 160.66,81.92 v160.66,76.2
  Bottom 0.406: B2.A5 152.4,75.56 153.03,76.2 v160.66,76.2
BATTERY_V+  (1 unrouted)
  Bottom 0.813: R24.1 123.19,77.47 123.83,78.11
  Bottom 1.27: MINISRV11.LEFT@1 195.66,96.44 195.58,96.52 | MINISRV11.LEFT@3 197.81,96.21 198.12,96.52 | MINISRV11.LEFT@4 198.88,92.83 200.03,93.98 | MINISRV11.LEFT@3 198.12,93.98 199.39,95.25 | MINISRV11.LEFT 195.66,93.58 MINISRV11.LEFT@2 197.66,93.98 MINISRV11.LEFT@3
  pour Bottom (isolate 0.61): 3.17,114.3 212.72,114.3 213.36,77.47 21.59,78.11 20.95,41.27 3.17,41.27
COIL_V-_1
  Top 0.406: D1.A 18.9,38.89 LED1.C 17.63,38.73 16.51,38.73 15.88,38.1 15.88,34.92 16.83,33.97 Q1.2
  Top 0.61: U$11.COIL_V_- 25.4,38.1 24.77,37.47 D1.A
COIL_V-_2
  Top 0.61: D2.A 135.1,91.44 LED9.C 139.55,91.29 139.7,91.44 139.7,92.22 Q2.2
  Top 0.813: D2.A 132.08,83.19 130.81,81.92 116.2,81.92 114.94,80.64 114.94,74.93 113.67,73.66 107.82,73.66 K3.1
COIL_V-_3
  Top 0.61: D3.A 100.18,92.08 LED11.C 103.99,91.29 104.78,92.08 104.78,93.5 Q3.2
  Top 0.813: D3.A 98.42,90.17 97.16,88.9 90.17,88.9 89.53,88.27 89.53,74.3 88.9,73.66 83.06,73.66 K2.1
COIL_V-_4
  Top 0.61: D4.A 65.25,92.71 LED13.C 68.43,91.92 69.22,92.71 69.22,94.77 Q4.2
  Top 0.813: D4.A 62.23,90.17 61.59,89.53 59.05,89.53 58.42,88.9 58.42,74.93 57.15,73.66 51.94,73.66 K1.1
D0
  Top 0.406: B2.D0 229.87,63.5 230.5,64.14 U$1.DIR
D1
  Top 0.406: B2.D1 229.87,60.96 232.41,58.42 255.27,58.42 255.91,59.05 U$2.DIR
D2
  Top 0.406: B2.D2 230.5,58.42 231.14,57.78 280.67,57.78 281.31,58.42 U$3.DIR
D3
  Bottom 0.406: U$1.PWM 227.97,62.87 203.84,62.87 203.2,62.23 203.2,56.52 202.56,55.88 B2.D3
D4
  Top 0.406: B2.D4 305.44,53.34 306.7,54.61 U$4.DIR
D5
  Bottom 0.406: B2.D5 203.84,50.8 204.47,51.44 204.47,60.96 205.1,61.59 228.6,61.59 229.87,62.87 252.73,62.87 253.37,63.5 U$2.PWM
D6
  Bottom 0.406: B2.D6 204.47,48.26 205.74,49.53 205.74,59.69 206.38,60.33 229.87,60.33 231.14,61.59 278.13,61.59 278.76,62.23 U$3.PWM
D7
  Top 0.406: B2.D7 212.72,45.72 214,46.99 214,51.44 214.63,52.07 329.56,52.07 332.11,54.61 U$5.DIR
D8
  Top 0.406: B2.D8 202.31,41.66 203.2,42.55 203.2,43.81 203.84,44.45 212.72,44.45 215.26,46.99 215.26,50.16 215.9,50.8 356.87,50.8 357.5,51.44 U$6.DIR
D9
  Bottom 0.406: U$4.PWM 304.17,61.59 303.53,60.96 233.04,60.96 231.14,59.05 207.65,59.05 207.01,58.42 207.01,48.9 203.84,45.72 203.84,40.01 203.2,39.37 200.91,39.37 B2.D9
D10
  Bottom 0.406: B2.D10 203.58,36.58 204.47,37.47 204.47,45.09 208.28,48.9 208.28,57.15 208.91,57.78 233.04,57.78 233.68,58.42 303.53,58.42 305.44,60.33 305.44,62.23 306.07,62.87 328.93,62.87 329.56,63.5 U$5.PWM
D11
  Bottom 0.406: B2.D11 202.95,34.04 203.84,34.92 203.84,35.56 205.74,37.47 205.74,45.09 208.91,48.26 208.91,55.88 209.55,56.52 233.68,56.52 234.95,57.78 354.33,57.78 354.96,58.42 U$6.PWM
D12  (via drill 0.6)
  Top 0.406: v198.12,79.38 210.82,79.38 218.44,87 218.44,107.31 147.96,107.31 147.32,107.95 147.32,112.39 146.69,113.03 106.68,113.03 105.41,111.76 70.48,111.76 69.85,111.12 S1.2
  Bottom 0.406: B2.D12 199.01,31.5 198.12,32.38 v198.12,79.38
D13  (via drill 0.6)
  Top 0.406: v196.85,81.28 211.46,81.28 217.17,87 217.17,106.05 146.69,106.05 146.05,106.68 146.05,111.12 145.41,111.76 107.31,111.76 106.68,111.12 S2.2
  Bottom 0.406: B2.D13 197.74,28.96 196.85,29.84 v196.85,81.28
ESTOP  (20 unrouted)
  Top 0.813: IC5.1 C7.1
  Top 1.676: C7.1 182.25,90.81 183.51,92.08 183.51,97.16 184.15,97.79 205.1,97.79 205.74,97.16 205.74,95.16 MINISRV11.RIGHT@1
GND  (via drill 0.6)
  Top 0.406: C9.- 65.41,61.59 66.04,60.96 66.04,53.34 66.67,52.7 68.58,52.7 69.22,52.07 IC3.2 69.22,49.53 69.85,48.9 79.38,48.9 80.01,49.53 80.01,60.96 80.64,61.59 C3.- | C3.- 87,61.59 87.63,60.96 87.63,53.34 88.27,52.7 90.17,52.7 90.81,52.07 IC2.2 90.81,49.53 91.44,48.9 99.69,48.9 100.33,49.53 100.33,60.96 100.97,61.59 C1.- | IC1.2 112.39,52.07 111.76,52.7 109.86,52.7 109.22,53.34 109.22,60.96 108.58,61.59 C1.- | C9.- 58.42,61.59 57.78,60.96 57.78,49.53 57.15,48.9 48.26,48.9 47.62,49.53 IC4.2 47.62,52.07 46.99,52.7 45.09,52.7 44.45,53.34 44.45,60.96 43.81,61.59 C5.- 38.1,63.5 38.73,64.14 C6.- | C9.- 59.69,63.5 60.33,64.14 C10.- | C4.- 82.55,64.14 81.92,63.5 C3.- | C1.- 102.23,63.5 102.87,64.14 C2.- | B2.GND@1 183.51,40.64 184.15,41.27 184.15,62.87 182.88,64.14 182.88,67.31 184.15,68.58 SV1.4 | U$4.GND2 U$4.GND1 R19.1 313.06,76.05 | U$3.GND2 U$3.GND1 R20.1 287.65,76.05 | U$2.GND2 U$2.GND1 R21.1 262.25,76.05 | U$1.GND2 U$1.GND1 R22.1 236.85,76.05 | U$5.GND2 U$5.GND1 R18.1 338.45,76.05 | R17.1 U$6.GND1 | U$6.GND1 U$6.GND2 | U$6.GND1 360.05,75.56 359.41,76.2 343.05,76.2 LED5.C 338.45,76.05 | 338.45,76.05 LED4.C 313.06,76.05 | 313.06,76.05 LED3.C 287.65,76.05 | 287.65,76.05 LED2.C 262.25,76.05 | 262.25,76.05 242.09,76.05 241.94,76.2 241.45,76.2 LED6.C 236.85,76.05 | 236.85,76.05 LED7.C | 196.85,27.3 197.49,26.67 200.41,26.67 B2.GND@3 | R23.2 IC6.4 | Q1.3 15.41,29.84 | 15.41,29.84 15.41,29.68 15.88,29.21 R7.2 24.77,29.21 25.4,28.57 25.4,22.23 26.04,21.59 R8.1 R25.2 | 15.41,29.84 14.78,29.21 13.97,29.21 13.34,28.57 LED8.C | v112.39,41.91 112.39,40.64 113.67,39.37 134.62,39.37
  Top 0.406: v140.34,41.91 140.34,42.55
  Top 0.61: R43.2 R42.1 47.62,106.05 49.53,107.95 56.52,107.95 57.15,107.31 57.15,101.6 57.78,100.97 R41.2 64.14,99.06 64.14,98.42 64.77,97.79 67.31,97.79 67.94,98.42 71.12,98.42 71.58,97.96 Q4.3 74.93,95.89 75.56,96.52 75.56,97.16 | 75.56,97.16 75.56,103.5 74.93,104.14 73.81,104.14 LED14.C | R37.2 R36.1 | R36.1 83.82,105.41 86.36,107.95 92.08,107.95 92.71,107.31 92.71,101.6 93.34,100.97 R35.2 99.06,100.97 99.69,100.33 99.69,99.06 101.6,97.16 106.68,97.16 107.31,96.52 107.31,94.78 Q3.3 111.76,94.61 112.39,95.25 112.39,98.42 112.39,102.87 111.76,103.5 110.64,103.5 LED12.C | R36.1 83.82,97.16 83.19,96.52 76.2,96.52 75.56,97.16 | R31.2 R30.1 118.11,106.05 121.28,107.95 126.36,107.95 126.36,101.6 127,100.97 R29.2 133.35,100.97 133.99,100.33 133.99,97.79 134.62,97.16 137.16,97.16 138.43,95.89 140.97,95.89 141.6,95.25 141.6,93.81 Q2.3 144.78,93.34 145.41,93.98 145.41,102.87 144.78,103.5 143.66,103.5 LED10.C
  Top 0.813: C7.2 159.38,98.42 160.02,99.06 166.37,99.06 167,98.42 IC5.2 167,93.34 167.64,92.71 170.81,92.71 171.45,93.34 171.45,100.33 170.18,101.6 149.86,101.6 148.59,100.33 148.59,93.98 147.96,93.34 144.78,93.34 | R31.2 112.39,98.42 | C7.2 159.38,84.45 158.75,83.82 158.75,73.66 159.38,73.03 161.29,73.03 163.19,71.12 163.19,43.18 161.93,41.91 | C7.2 C8.2
  Bottom 0.406: IC1.2 v112.39,41.91 | IC6.4 139.7,59.69 140.34,59.05 v140.34,41.91
  pour Top (isolate 0.406): 338.45,114.3 378.46,114.94 379.1,113.67 379.1,1.27 378.46,0.64 29.84,0.64 29.21,1.27 29.21,23.5 38.1,23.5 38.1,18.41 134.62,18.41 134.62,42.55 162.56,42.55 162.56,28.57 310.51,27.94 311.15,29.21 355.6,29.21 356.87,30.48 356.87,41.91 356.24,42.55 340.36,42.55 340.36,38.1 331.47,38.1 331.47,42.55 314.96,42.55 314.96,38.73 306.7,38.73 306.07,39.37 306.07,41.91 305.44,42.55 290.19,42.55 290.19,38.73 280.67,38.73 280.67,43.18 264.16,43.18 264.16,38.73 263.52,38.1 255.91,38.1 255.27,38.73 255.27,42.55 254.63,43.18 238.76,43.18 238.76,38.1 229.87,38.1 229.87,48.26 231.14,50.16 361.31,50.16 361.95,50.8 361.95,84.45 361.31,85.72 339.09,85.72 337.82,87 337.82,113.67
IC1_IN
  Bottom 3: K3.S 119.63,38.35 118.75,37.47 107.95,37.47 107.95,31.94 IC1.IP+@7
IC2_IN
  Bottom 3: K2.S 94.87,72.77 97.79,70.48 97.79,41.91 96.52,40.64 85.72,40.64 85.09,40.01 85.09,31.89 IC2.IP+@6
IC3_IN
  Bottom 3: K1.S 63.75,70.87 64.14,70.48 74.3,70.48 75.56,69.22 75.56,41.27 73.66,39.37 66.04,39.37 64.77,38.1 64.77,31.75 | 64.77,31.11 64.77,31.75 | 64.77,31.75 IC3.IP+@7
N$1
  Top 0.406: R26.1 19.05,16.51 19.05,22.23 18.41,22.86 13.97,22.86 13.34,23.5 LED8.A
N$2
  Top 0.406: IC1.3 107.5,51.24 R1.1
N$3
  Top 0.406: LED1.A 19.2,36.04 R4.1
N$4
  Top 0.406: R1.2 C1.+ 102.23,48.9 102.87,48.26 115.57,48.26 116.2,48.9 116.2,57.78 116.84,58.42 B2.A3
N$5
  Top 0.406: R23.1 123.19,60.96 123.83,61.59 132.72,61.59 133.35,62.23 134.62,62.23 | 134.62,62.23 IC6.3 | R24.2 133.99,64.14 134.62,63.5 134.62,62.23
N$6
  Top 0.406: IC2.3 85.92,51.24 R2.1
N$7
  Top 0.61: R27.1 132.72,94.61 133.35,93.98 135.1,93.98 LED9.A
N$8
  Top 0.406: R2.2 C3.+ 81.92,46.99 82.55,46.35 116.2,46.35 117.47,47.62 117.47,55.24 118.11,55.88 B2.A2
N$9
  Top 0.61: R28.2 133.99,95.89 137.16,95.89 137.79,95.25 137.79,94.61 138.43,93.98 139.56,93.98 Q2.1
N$10
  Top 0.406: R3.1 42.73,51.24 IC4.3
N$11
  Top 0.61: OK2.3 123.19,106.05 123.83,105.41 123.83,101.6 123.19,100.97 R29.1 R28.1
N$12
  Top 0.61: R30.2 118.11,109.22 129.54,109.22 OK2.2
N$13
  Top 0.406: R5.2 C9.+ 59.69,45.09 60.33,44.45 116.84,44.45 118.75,46.35 118.75,52.7 119.38,53.34 B2.A1
N$14
  Top 0.61: R32.1 136.53,99.06 137.79,97.79 143.03,97.79 143.03,100.66 LED10.A
N$15
  Top 0.61: R33.1 99.85,95.25 LED11.A
N$16
  Top 0.406: Q1.1 20,32.07 R6.2
N$17
  Top 0.406: IC3.3 64.33,51.24 R5.1
N$18
  Top 0.61: R34.2 99.06,97.79 100.97,95.89 104.62,95.89 Q3.1
N$19
  Top 0.406: R3.2 C5.+ 38.1,43.81 38.73,43.18 118.11,43.18 120.02,45.09 120.02,50.16 120.65,50.8 B2.A0
N$20
  Top 0.61: OK3.3 89.53,106.05 90.17,105.41 90.17,101.6 89.53,100.97 R35.1 R34.1
N$21
  Top 0.406: R6.1 R7.1 29.21,29.21 28.57,28.57 28.57,24.77 29.21,24.13 OK1.3
N$22
  Top 0.61: OK3.2 95.89,108.58 95.25,109.22 84.45,109.22 R36.2
N$23
  Top 0.61: R38.1 103.5,98.42 110.49,98.42 LED12.A
N$24
  Bottom 2.54: IC4.IP+@4 39.45,34.21 38.73,34.92
  pour Bottom (isolate 0.406): 24.13,66.67 45.72,66.67 45.72,66.04 45.09,24.77 24.13,24.77
N$25
  Top 0.61: R39.1 65.56,95.25 LED13.A
N$26
  Top 0.61: R40.2 62.87,97.79 64.14,96.52 69.07,96.52 Q4.1
N$27
  Top 0.61: R40.1 R41.1 53.34,100.97 53.98,101.6 53.98,105.41 53.34,106.05 OK4.3
N$28
  Top 0.61: R42.2 48.26,109.22 59.05,109.22 59.69,108.58 OK4.2
N$29
  Top 0.61: R44.1 73.03,99.69 73.66,100.33 LED14.A
N$34
  Top 0.406: R8.2 OK1.2
N$35
  Top 0.406: U$5.VREF 334.64,60.33 335.28,59.69 R18.2
N$37
  Top 0.406: U$3.VREF 283.85,60.33 284.48,59.69 R20.2
N$50
  Top 0.406: R9.1 267.33,82.55 266.7,81.92 LED2.A
N$51
  Top 0.406: U$6.VREF 360.05,60.33 360.68,59.69 R17.2
N$52  (via drill 0.6)
  Top 0.406: v170.81,34.29 170.81,33.02 193.68,33.02 194.31,32.38 194.31,19.68 194.94,19.05 200.41,19.05 B2.SCL | SV1.1 176.53,73.66 175.9,74.3 162.56,74.3 162.56,80.64 R15.2
  Bottom 0.406: SV1.1 171.45,71.12 170.81,70.48 v170.81,34.29
N$53  (via drill 0.6)
  Top 0.406: v172.09,34.29 194.94,34.29 195.58,33.66 195.58,22.23 196.22,21.59 200.41,21.59 B2.SDA | SV1.2 179.07,75.56 178.44,76.2 R14.2
  Bottom 0.406: SV1.2 179.07,69.22 178.44,68.58 172.72,68.58 172.09,67.94 v172.09,34.29
N$54
  Top 0.406: R10.1 293.37,82.55 292.74,81.92 LED3.A
N$56
  Top 0.406: R11.1 318.77,83.19 318.13,82.55 LED4.A
N$60
  Top 0.406: R12.1 343.54,82.55 342.9,81.92 LED5.A
N$61
  Top 0.406: U$4.VREF 309.25,60.33 309.88,59.69 R19.2
N$62
  Top 0.406: R13.1 241.94,83.19 241.3,82.55 LED6.A
N$64
  Top 0.406: R16.1 216.53,82.55 215.9,81.92 LED7.A
N$65
  Top 0.406: U$2.VREF 258.44,60.33 259.08,59.69 R21.2
N$66
  Top 0.406: U$1.VREF 233.04,60.33 233.68,59.69 R22.2
N$72
  Top 0.406: U$6.SLP S8.2 349.25,74.3 R12.2
N$73
  Top 0.406: U$5.SLP S6.2 323.85,74.3 R11.2
N$74
  Top 0.406: U$4.SLP S7.2 299.08,74.3 R10.2
N$75
  Top 0.406: U$3.SLP S5.2 273.05,74.3 R9.2
N$76
  Top 0.406: U$2.SLP S4.2 247.01,74.3 R13.2
N$77
  Top 0.406: U$1.SLP S3.2 222.25,74.3 R16.2
OPTO1
  Top 0.61: R31.1 115.57,109.86 116.2,110.49 132.72,110.49 | 132.72,110.49 134.62,110.49 R32.2 135.89,102.87 136.53,102.23 138.43,102.23 S9.1 | OK2.1 132.08,103.5 132.72,104.14 132.72,110.49
OPTO2
  Top 0.61: R37.1 80.01,109.86 80.64,110.49 99.06,110.49 | 99.06,110.49 102.23,110.49 102.87,109.86 R38.2 102.87,102.23 103.5,101.6 106.05,101.6 S2.1 | OK3.1 97.79,103.5 98.42,104.14 98.42,109.86 99.06,110.49
OPTO3
  Top 0.61: R43.1 44.45,110.49 62.23,110.49 | 62.23,110.49 66.04,110.49 R44.2 66.04,105.41 66.67,104.78 69.22,104.78 69.85,104.14 S1.1 | OK4.1 60.96,103.5 61.59,104.14 61.59,109.86 62.23,110.49
OPTO4
  Top 0.406: OK1.1 R26.2 | R26.2 S10.1 | R25.1 20.95,19.05 20.32,19.68 R26.2
OUT1
  Top 3: U$13.P$12 114.75,21.4 117.47,24.13 117.47,27.25 IC1.IP-@15
OUT2
  Top 3: IC2.IP-@12 92.63,22.91 U$13.P$10
OUT3
  Top 3: IC3.IP-@17 77.39,23.73 U$13.P$8
OUT4
  Bottom 1.27: IC4.IP-@3 58.42,32.38
  pour Bottom (isolate 0.406): 48.26,35.56 48.26,1.27 219.71,1.27 220.34,1.91 220.34,36.83 219.07,38.1 219.07,41.27 220.34,42.55 236.22,42.55 236.22,38.73 236.85,38.1 243.84,38.1 244.47,38.73 244.47,41.91 245.11,42.55 261.62,42.55 261.62,38.73 262.89,38.1 269.24,38.1 269.88,38.73 269.88,41.91 270.51,42.55 286.38,42.55 286.38,38.73 288.29,38.1 294.64,38.1 295.27,38.73 295.27,41.91 295.91,42.55 312.42,42.55 312.42,38.73 313.69,38.1 320.04,38.1 320.68,38.73 320.68,41.91 321.31,42.55 337.82,42.55 337.82,38.73 339.09,38.1 345.44,38.1 346.07,38.73 346.07,55.24 344.17,57.15 210.82,57.15 203.2,49.53 203.2,18.41 202.56,17.78 131.44,17.78 128.27,14.61 59.69,14.61 59.69,34.92 58.42,35.56
OUTA1
  Bottom 1.27: U$1.P$18 U$1.P$17
  Bottom 3: U$12.P$3 289.88,5.41 289.56,4.45 239.4,4.45 238.76,5.08 238.76,22.23 237.49,22.86 220.98,22.86 220.34,23.5 U$1.P$17
OUTA2
  Bottom 1.27: U$2.P$18 U$2.P$17
  Bottom 2.5: 283.21,12.7 274.95,12.7
  Bottom 3: U$12.P$2 284.19,13.68 283.21,12.7 | 274.95,12.7 247.65,12.7 245.75,14.61 U$2.P$17
OUTA3
  Bottom 1.27: U$3.P$18 U$3.P$17
  Bottom 3: U$12.P$1 278.11,15.9 273.69,17.78 271.14,19.05 U$3.P$17
OUTA4
  Bottom 1.27: U$4.P$18 U$4.P$17
  Bottom 3: U$12.P$6 308,15.9 311.79,19.68 311.79,34.29 310.51,35.56 297.81,35.56 296.55,36.83 U$4.P$17
OUTA5
  Bottom 1.27: U$5.P$18 U$5.P$17
  Bottom 2.5: 302.26,12.7 310.51,12.7
  Bottom 3: U$12.P$5 301.29,13.68 302.26,12.7 | 310.51,12.7 321.94,24.13 U$5.P$17
OUTA6
  Bottom 1.27: U$6.P$18 U$6.P$17
  Bottom 3: U$12.P$4 295.58,5.41 296.55,4.45 314.32,4.45 347.35,37.47 U$6.P$17
OUTB1
  Top 1.27: U$1.P$20 U$1.P$19
  Top 3: U$12.P$7 278.49,26.95 276.86,28.57 226.06,28.57 225.43,29.21 U$1.P$19
OUTB2
  Top 1.27: U$2.P$20 U$2.P$19
  Top 3: U$12.P$8 283.85,21.74 283.85,26.67 278.13,32.38 252.09,32.38 250.82,33.66 U$2.P$19
OUTB3
  Top 1.27: U$3.P$20 U$3.P$19
  Top 3: U$12.P$9 289.88,28.89 282.57,36.2 276.86,36.2 276.23,36.83 U$3.P$19
OUTB4
  Top 1.27: U$4.P$20 U$4.P$19
  Top 3: U$4.P$19 301.62,34.92 295.27,28.57 295.27,21.71 U$12.P$10
OUTB5
  Top 1.27: U$5.P$20 U$5.P$19
  Top 3: U$5.P$19 327.02,36.83 326.39,36.2 309.25,36.2 301.62,28.57 301.62,21.74 U$12.P$11
OUTB6
  Top 1.27: U$6.P$20 U$6.P$19
  Top 3: U$12.P$12 306.99,28.22 310.51,31.75 351.15,31.75 352.43,33.02 U$6.P$19
VOLTAGE_REG_OUT
  Top 0.406: D1.C R4.2 31.75,34.92 32.38,34.29 32.38,27.3 31.75,26.67 OK1.4
  Top 0.61: OK4.4 51.44,103.5 50.16,102.23 50.16,95.89 50.8,95.25 R39.2 D4.C | OK3.4 87,103.5 86.36,102.87 86.36,95.89 87,95.25 R33.2 D3.C | OK2.4 121.28,103.5 120.02,102.23 120.02,95.25 120.65,94.61 R27.2 D2.C
  Top 0.813: IC5.3 169.54,99.69 168.91,100.33 154.31,100.33 153.67,99.69 153.67,92.08 152.4,90.81 C8.1 148.59,90.81 147.32,89.53 147.32,70.48 | 82.55,85.85 K2.2 | D2.C 108.58,91.44 107.95,90.81 107.95,86.49 K3.2 107.44,82.68 107.31,82.55 102.87,82.55 102.23,81.92 102.23,69.22 | D3.C 83.19,92.08 82.55,91.44 82.55,86.11 K2.2 | 51.44,85.85 K1.2 52.07,86.49 | D4.C 52.07,86.49 | U$11.COI_V_+ 15.24,68.58 15.88,69.22 46.35,69.22 | B2.VIN 159.38,45.72 161.29,47.62 161.29,69.85 160.66,70.48 147.32,70.48 | 102.23,69.22 113.03,69.22 114.3,70.48 147.32,70.48 | 52.07,86.49 47.12,86.49 46.35,85.72 46.35,69.22 | 46.35,69.22 74.93,69.22 | 74.93,69.22 75.56,69.85 75.56,84.45 76.83,85.72 82.42,85.72 K2.2 | 102.23,69.22 74.93,69.22
  Bottom 0.61: D1.C 30.48,40.64 29.84,41.27 15.88,41.27 15.24,41.91 U$11.COI_V_+

### Text on the board
tNames: Dylan Lamont 2019 | DRIVER 1 | DRIVER 2 | DRIVER 3 | DRIVER 4 | DRIVER 5 | DRIVER 6 | OUT A 1 | OUT A 2 | OUT A 3 | OUT A 4 | OUT A 5 | OUT A 6 | OUT B 3 | OUT B 2 | OUT B 1 | OUT B 6 | OUT B 5 | OUT B 4